# Altium project VHF_AMP.PrjPcb (part 3 of 5)

## Sheet VHFA_DIOT_Connectors_P1_P6.SchDoc: =MainTitle
size 420 x 297 mm; SPICEModelCacheRMUUFYQV: <root> / <DocumentId>RMUUFYQV</DocumentId> / </root>; Author: G.Kasprowicz; CompanyName: WUT ISE; DrawnBy: G.Kasprowicz; Organization: WUT ISE; Address1: PW ISE; Address2: Nowowiejska 15/19 00-665 Warsaw; Address3: gkasprow@gmail.com; DocumentNumber: 5; Revision: 2; SheetNumber: 5; SheetTotal: 9; ModifiedBy: -; CheckedDate: -; Title2: DIOT connectors; DivGrp: WUT ISE; Designer: G.Kasprowicz; ModifiedDate: -; ProjectName: Sensor Box
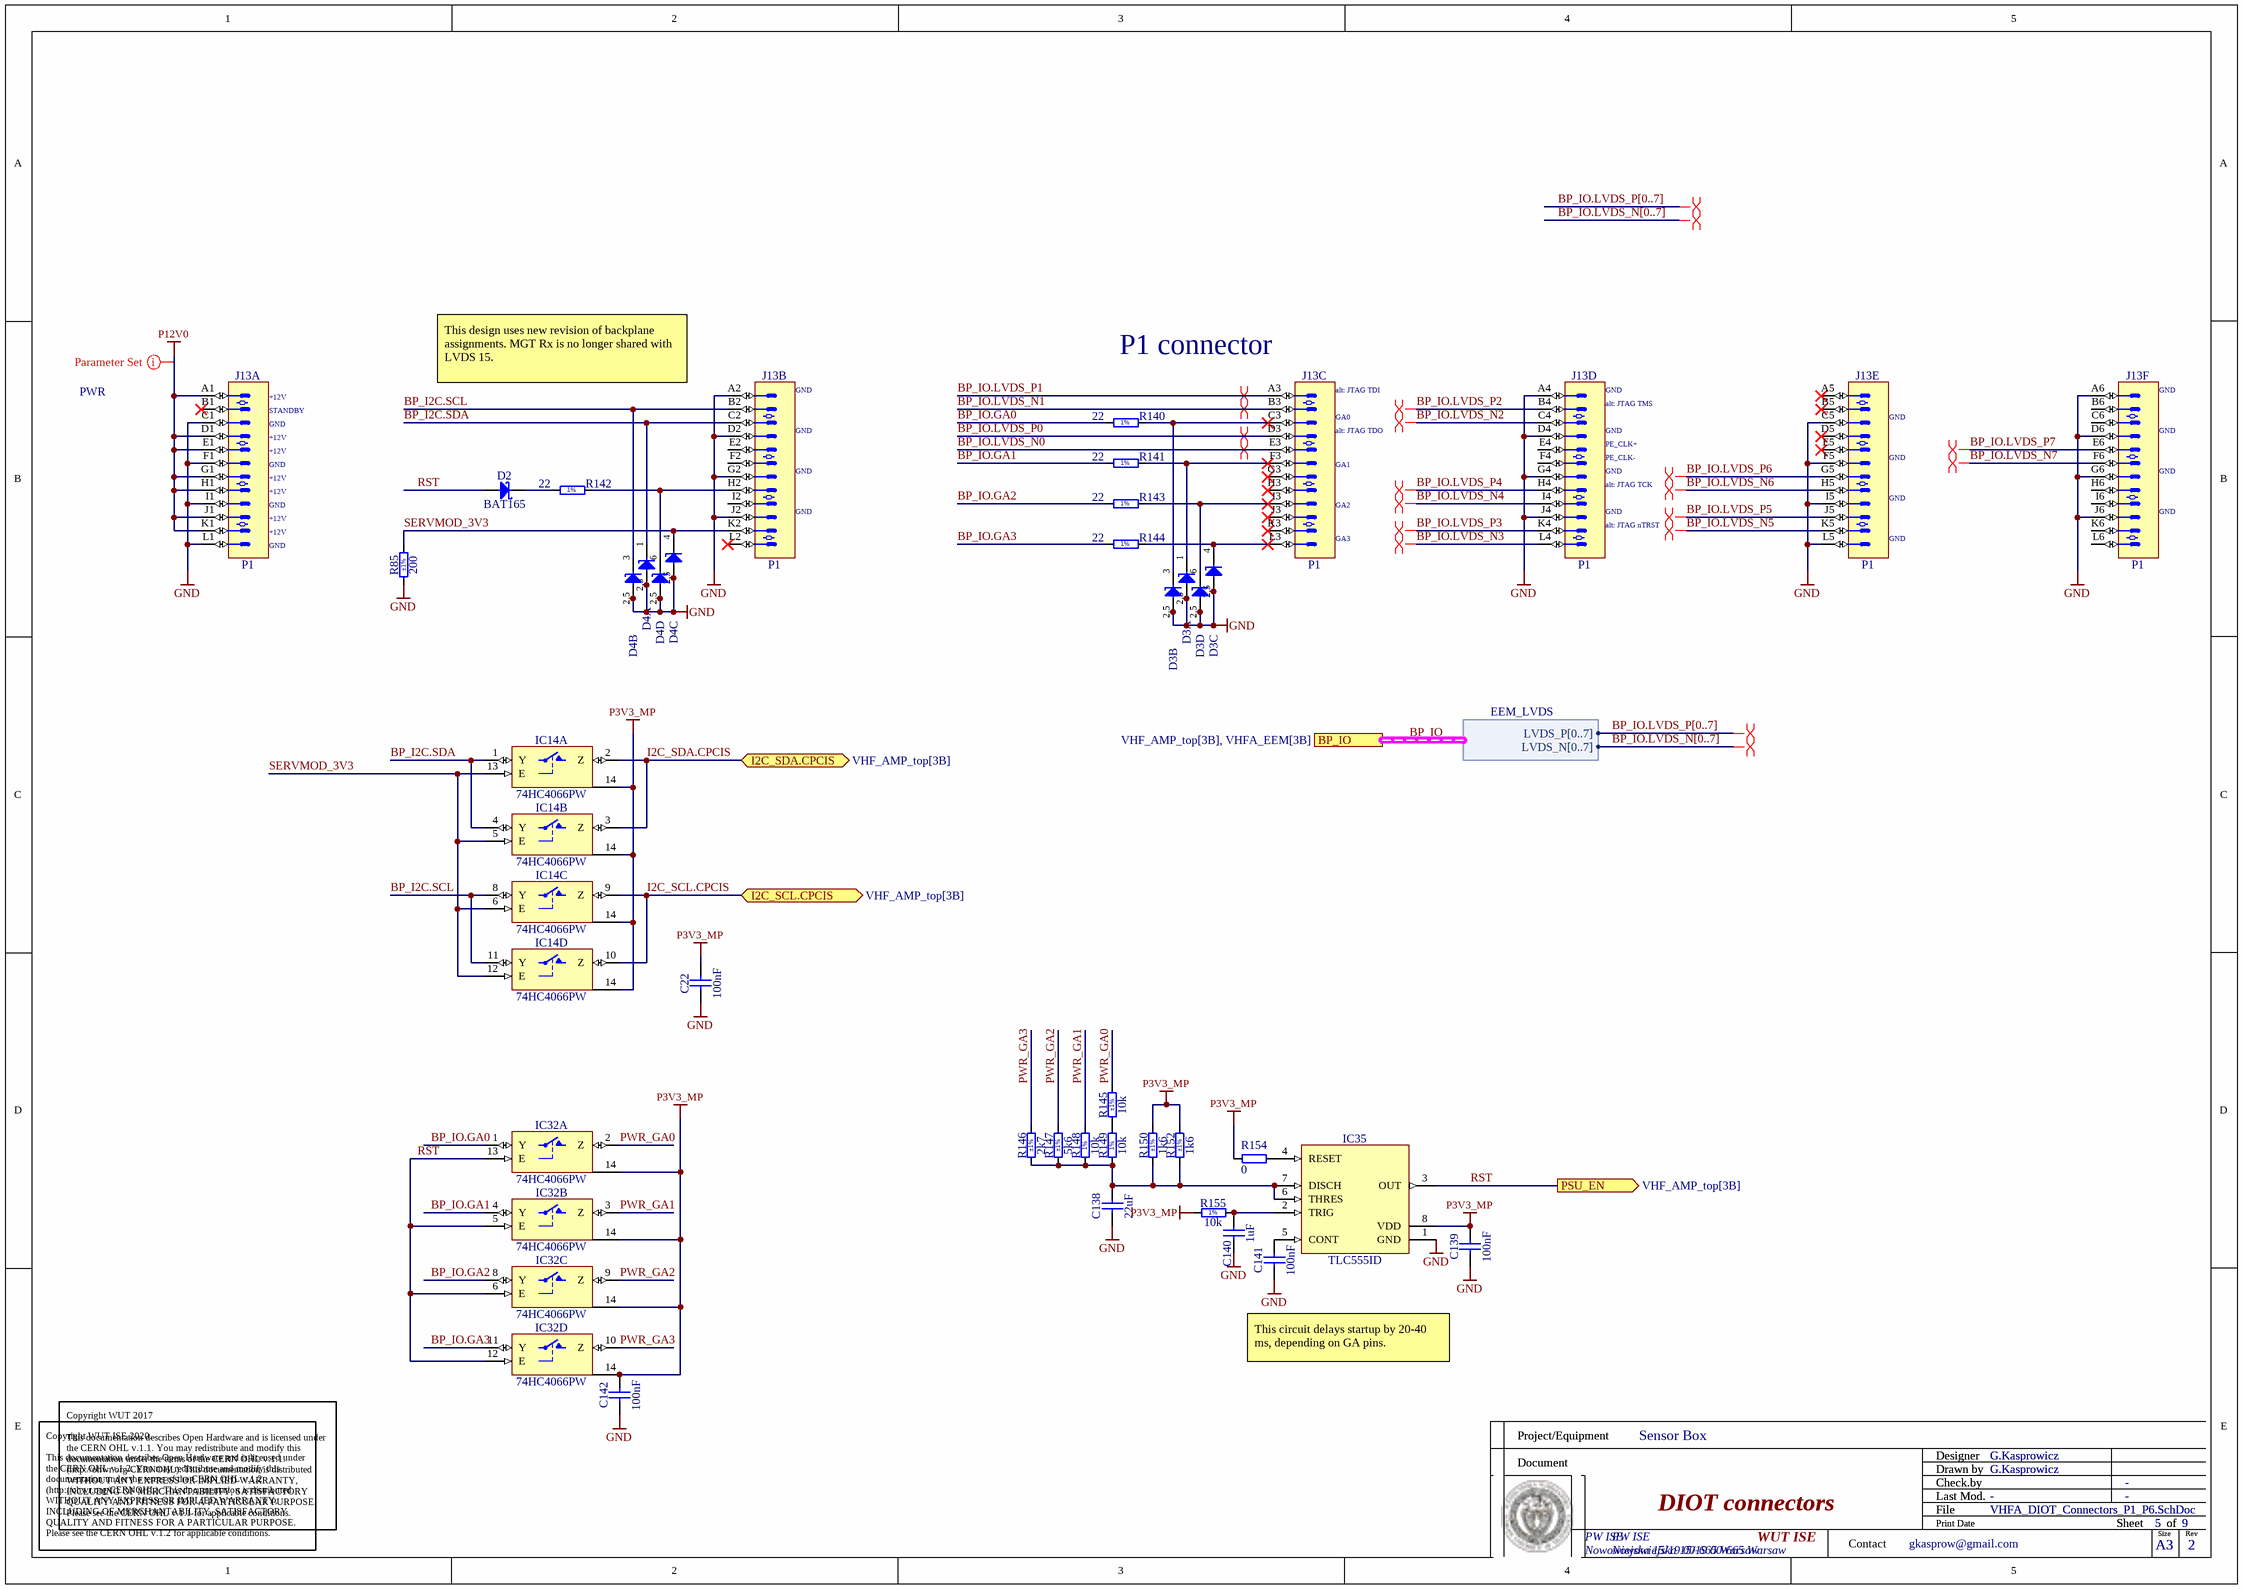
[diagram p4: VHFA_DIOT_Connectors_P1_P6.SchDoc]

### Parts
C22  100nF  [CAPC1608X87N]
C138  22uF  [CAPC3216X180N]
C139  100nF  [CAPC1005X55N]
C140  1uF  [CAPC1005X55N]
C141  100nF  [CAPC1005X55N]
C142  100nF  [CAPC1005X55N]
D2  BAT165  [SOD2512X110N]
D3  PESD3V3S4UD  [SOT95P280X110-6N]  (value not drawn)  (parts A,B,C,D of 4)
D4  PESD3V3S4UD  [SOT95P280X110-6N]  (value not drawn)  (parts A,B,C,D of 4)
IC14  74HC4066PW  [SOP65P640X110-14N]  (parts A,B,C,D of 4)
IC32  74HC4066PW  [SOP65P640X110-14N]  (parts A,B,C,D of 4)
IC35  TLC555ID  [SOIC127P600X175-8N]
J13  P1  [AMPHENOL_10052825-101LF]  (parts A,B,C,D,E,F of 6)
R85  200  Tolerance: ±1%  [RESC1608X55N]
R140  22  [RESC1005X40N]
R141  22  [RESC1005X40N]
R142  22  [RESC1005X40N]
R143  22  [RESC1005X40N]
R144  22  [RESC1005X40N]
R145  10k  Tolerance: ±1%  [RESC1005X40N]
R146  2k7  Tolerance: ±1%  [RESC1608X55N]
R147  5k6  Tolerance: ±1%  [RESC1005X40N]
R148  10k  [RESC1005X40N]
R149  10k  [RESC1005X40N]
R150  1k6  Tolerance: ±1%  [RESC1005X40N]
R152  1k6  Tolerance: ±1%  [RESC1005X40N]
R154  0  [RESC1005X40N]
R155  10k  [RESC1005X40N]

### Ports
BP_IO (harness EEM_LVDS, see VHF_AMP_top[3B], VHFA_EEM[3B]), I2C_SCL.CPCIS (bidir, see VHF_AMP_top[3B]), I2C_SDA.CPCIS (bidir, see VHF_AMP_top[3B]), PSU_EN (out, see VHF_AMP_top[3B])

### Harnesses
EEM_LVDS: LVDS_P[0..7], LVDS_N[0..7]

### Nets
GND: C22.1 C138.1 C139.1 C140.1 C141.1 C142.1 D3.2(A) D3.5(A) D4.2(A) D4.5(A) IC14.7(GND) IC32.7(GND) IC35.1(GND) J13.A2 J13.A4 J13.A6 J13.C1 J13.C5 J13.D2 J13.D4 J13.D6 J13.F1 J13.F5 J13.G2 J13.G4 J13.G6 J13.I1 J13.I5 J13.J2 J13.J4 J13.J6 J13.L1 J13.L5 R85.1
P3V3_MP: C22.2 C139.2 C142.2 IC14.14(VCC) IC32.14(VCC) IC35.8(VDD) R150.2 R152.2 R154.2 R155.1
P12V0: J13.A1 J13.D1 J13.E1 J13.G1 J13.H1 J13.J1 J13.K1
BP_I2C.SCL: D4.3(C) IC14.8(Y) IC14.11(Y) J13.B2
BP_I2C.SDA: D4.1(C) IC14.1(Y) IC14.4(Y) J13.C2
BP_IO.GA0: IC32.1(Y) R140.1
BP_IO.GA1: IC32.4(Y) R141.1
BP_IO.GA2: IC32.8(Y) R143.1
BP_IO.GA3: IC32.11(Y) R144.1
BP_IO.LVDS_N0: J13.E3
BP_IO.LVDS_N1: J13.B3
BP_IO.LVDS_N2: J13.C4
BP_IO.LVDS_N3: J13.L4
BP_IO.LVDS_N4: J13.I4
BP_IO.LVDS_N5: J13.K5
BP_IO.LVDS_N6: J13.H5
BP_IO.LVDS_N7: J13.F6
BP_IO.LVDS_P0: J13.D3
BP_IO.LVDS_P1: J13.A3
BP_IO.LVDS_P2: J13.B4
BP_IO.LVDS_P3: J13.K4
BP_IO.LVDS_P4: J13.H4
BP_IO.LVDS_P5: J13.J5
BP_IO.LVDS_P6: J13.G5
BP_IO.LVDS_P7: J13.E6
I2C_SCL.CPCIS: IC14.9(Z) IC14.10(Z) ; port I2C_SCL.CPCIS
I2C_SDA.CPCIS: IC14.2(Z) IC14.3(Z) ; port I2C_SDA.CPCIS
PWR_GA0: IC32.2(Z) R145.2
PWR_GA1: IC32.3(Z) R148.2
PWR_GA2: IC32.9(Z) R147.2
PWR_GA3: IC32.10(Z) R146.2
RST: D2.2(A) IC32.5(E) IC32.6(E) IC32.12(E) IC32.13(E) IC35.3(OUT) ; port PSU_EN  [project net PS_ON_BP]
SERVMOD_3V3: D4.4(C) IC14.5(E) IC14.6(E) IC14.12(E) IC14.13(E) J13.K2 R85.2
NetC138_2: C138.2 IC35.6(THRES) IC35.7(DISCH) R146.1 R147.1 R148.1 R149.1 R150.1 R152.1
NetC140_2: C140.2 IC35.2(TRIG) R155.2
NetC141_2: C141.2 IC35.5(CONT)
NetD2_1: D2.1(C) R142.1
NetD3_1: D3.1(C) J13.F3 R141.2
NetD3_3: D3.3(C) J13.C3 R140.2
NetD3_4: D3.4(C) J13.L3 R144.2
NetD3_6: D3.6(C) J13.I3 R143.2
NetD4_6: D4.6(C) J13.H2 R142.2
NetIC35_4: IC35.4(RESET) R154.1
NetR145_1: R145.1 R149.2

Not connected (* = marked no-connect by the designer): J13 A5* B1* B5* B6 C6 D5* E2 E4 E5* F2 F4 G3* H3* H6 I2 I6 J3* K3* K6 L2* L6

### Buses and harness runs
bus BP_IO.LVDS_N[0..7]
bus BP_IO.LVDS_P[0..7]
harness BP_IO = port BP_IO

### Layout directives
net class PWR: P12V0
differential pair: (no net found under the mark), BP_IO.LVDS_N0, BP_IO.LVDS_N1, BP_IO.LVDS_N2, BP_IO.LVDS_N3, BP_IO.LVDS_N4, BP_IO.LVDS_N5, BP_IO.LVDS_N6, BP_IO.LVDS_N7, BP_IO.LVDS_P0, BP_IO.LVDS_P1, BP_IO.LVDS_P2, BP_IO.LVDS_P3, BP_IO.LVDS_P4, BP_IO.LVDS_P5, BP_IO.LVDS_P6, BP_IO.LVDS_P7

### Notes on the sheet
- (near J13) +12V
- This design uses new revision of backplane assignments. MGT Rx is no longer shared with LVDS 15.
- (near J13) GND
- (near J13) P1 connector
- (near J13) alt: JTAG TDI
- (near J13) STANDBY
- (near J13) alt: JTAG TDO
- (near J13) GA0
- (near J13) alt: JTAG TMS
- (near J13) PE_CLK+
- (near J13) PE_CLK-
- (near J13) GA2
- (near J13) GA1
- (near J13) alt: JTAG TCK
- (near J13) alt: JTAG nTRST
- (near J13) GA3
- This circuit delays startup by 20-40 ms, depending on GA pins.
- Project/Equipment
- Document
- Designer
- Drawn by
- Check.by
- Copyright WUT ISE 2020.
  This documentation describes Open Hardware and is licensed under the CERN OHL v.1.2. You may redistribute and modify this documentation under the terms of the CERN OHL v.1.2. (http://ohwr.org/CERNOHL). This documentation is distributed WITHOUT ANY EXPRESS OR IMPLIED WARRANTY, INCLUDING OF MERCHANTABILITY, SATISFACTORY QUALITY AND FITNESS FOR A PARTICULAR PURPOSE. Please see the CERN OHL v.1.2 for applicable conditions.
- Copyright WUT 2017
  This documentation describes Open Hardware and is licensed under the CERN OHL v.1.1. You may redistribute and modify this documentation under the terms of the CERN OHL v.1.1. (http://ohwr.org/CERNOHL). This documentation is distributed WITHOUT ANY EXPRESS OR IMPLIED WARRANTY, INCLUDING OF MERCHANTABILITY, SATISFACTORY QUALITY AND FITNESS FOR A PARTICULAR PURPOSE. Please see the CERN OHL v.1.1 for applicable conditions.
- Contact
- File
- Last Mod.
- Print Date
- Sheet
- Size
- A3
- of
- Rev
- (in symbol PESD3V3S4UD, part A) 2,5
- (in symbol PESD3V3S4UD, part B) 2,5
- (in symbol PESD3V3S4UD, part C) 2,5
- (in symbol PESD3V3S4UD, part D) 2,5
- (in symbol R0402_1k_1%_0.0625W_100PPM) 1%
- (in symbol R0402_10K_1%_0.0625W_100PPM) 1%
- (in symbol R0402_22R_1%_0.0625W_100PPM) 1%

### Library data of the parts
C22 = CC0603_100NF_50V_10%_X7R: Non-polarised capacitor; Part Description: SMD Multilayer Chip Ceramic Capacitor; Manufacturer: GENERIC; Manufacturer1 Part Number: 223858615649; Voltage: 50V; TC: X7R; Tolerance: ±10%; Part Number: CC0603_100NF_50V_10%_X7R; Component Kind: Standard; Component Type: Standard; Pin Count: 2; Value: 100nF; Status: Preferred; Manufacturer Part Number: CC0603_100NF_50V_10%_X7R; Case: 0603; Mounted: Yes; Socket: No; SMD: Yes; Sense: No; Manufacturer1 Example: PHYCOMP; Manufacturer1 ComponentHeight: 0.87mm; HelpURL: \\cern.ch\dfs\Applications\Altium\Datasheets\CC0603_X7R_PHYCOMP.pdf; Author: CERN DEM JLC; CreateDate: 03.12.2007; LatestRevisionDate: 03.12.2007
C138 = CC1206_22UF_35V_20%_JB_TDK_C3216JB1V226M160AC: Non-polarised capacitor; Part Description: SMD Multilayer Chip Ceramic Capacitor; Manufacturer: TDK; Voltage: 35V; TC: JB(±10%); Tolerance: ±20%; Part Number: CC1206_22UF_35V_20%_JB_TDK_C3216JB1V226M160AC; Component Kind: Standard; Component Type: Standard; Pin Count: 2; Value: 22uF; Status: None; Manufacturer Part Number: C3216JB1V226M160AC; Case: 1206; Mounted: Yes; Socket: No; SMD: Yes; Sense: No; HelpURL: \\cern.ch\dfs\Applications\Altium\Datasheets\CC1206_TDK_C3216JB1V226M160AC.pdf; Author: CERN DEM JLC; CreateDate: 13.07.2017; LatestRevisionDate: 13.07.2017; ComponentHeight: 1.8mm
C139 C141 C142 = CC0402_100NF_16V_10%_X5R: as C108 on sheet VHF_AMP_top; Part Number: CC0402_100NF_16V_10%_X5R; Component Kind: Standard; Component Type: Standard; Pin Count: 2; Value: 100nF; Status: None; Manufacturer Part Number: CC0402_100NF_16V_10%_X5R; Case: 0402; Mounted: Yes; Socket: No; SMD: Yes; Sense: No; Manufacturer1 Example: MURATA; Manufacturer1 ComponentHeight: 0.55mm; HelpURL: \\cern.ch\dfs\Applications\Altium\Datasheets\CC0402_X5R_MURATA_GRM.pdf; Author: CERN DEM JLC; CreateDate: 10.12.2013; LatestRevisionDate: 10.12.2013
C140 = CC0402_1UF_16V_10%_X5R: as C69 on sheet VHF_AMP_top; Part Number: CC0402_1UF_16V_10%_X5R; Component Kind: Standard; Component Type: Standard; Pin Count: 2; Value: 1uF; Status: Preferred; Manufacturer Part Number: CC0402_1UF_16V_10%_X5R; Case: 0402; Mounted: Yes; Socket: No; SMD: Yes; Sense: No; Manufacturer1 Example: TDK; Manufacturer1 ComponentHeight: 0.55mm; HelpURL: \\cern.ch\dfs\Applications\Altium\Datasheets\CC0402_X5R_TDK_C.pdf; Author: CERN DEM JLC; CreateDate: 2012-10-25; LatestRevisionDate: 2012-10-25
D2 = BAT165: Schottky Diode; Part Description: Medium Power AF Schottky Diode; Manufacturer: INFINEON; Voltage: 40V; Power: 750mA; PressFit: No; Bonding: No; Part Number: BAT165; Component Kind: Standard; Component Type: Standard; Device: BAT165; PackageDescription: Small Outline Diode (SOD-323), 1.70mm W X 1.25mm L X 1.10mm H body,  IPC Medium Density; Manufacturer Part Number: BAT165; Pin Count: 2; Case: SOD-323; Mounted: Yes; Socket: No; SMD: Yes; Sense: No; ComponentHeight: 1.1mm; HelpURL: \\cern.ch\dfs\Applications\Altium\Datasheets\BAT165.pdf; Author: CERN DEM JLC; CreateDate: 12.11.2014; LatestRevisionDate: 12.11.2014
D3 D4 = PESD3V3S4UD: Quad Common Anode ESD Protection Diodes (30kV); Manufacturer: NXP SEMICONDUCTORS; Voltage: 3V3; Power: 200W; PressFit: No; Bonding: No; Part Number: PESD3V3S4UD; Component Kind: Standard; Component Type: Standard; Device: PESD3V3S4UD; PackageDescription: SOT, 0.95mm Pitch; 6 Pin, 1.60mm W X 2.90mm L X 1.10mm H body, IPC Medium Density; Part Description: Quad Common Anode ESD Protection Diodes (30kV); Manufacturer Part Number: PESD3V3S4UD; Pin Count: 6; Case: SOT23-6; Mounted: Yes; Socket: No; SMD: Yes; Sense: No; ComponentHeight: 1.1mm; HelpURL: \\cern.ch\dfs\Applications\Altium\Datasheets\PESD3V3S4UD.pdf; Author: CERN DEM MR; CreateDate: 08.02.2016; LatestRevisionDate: 16.01.2018
IC14 IC32 = 74HC4066PW: Part Description: Quad Single-Pole Single-Throw Analog Switch; Manufacturer: NXP SEMICONDUCTORS; PressFit: No; Bonding: No; Part Number: 74HC4066PW; Component Kind: Standard; Component Type: Standard; Device: 74HC4066PW; PackageDescription: SOP, 14-Leads, Body 4.4x5mm (max), Pitch 0.65mm, IPC Medium Density; Manufacturer Part Number: 74HC4066PW; Pin Count: 14; Case: TSSOP14; Mounted: Yes; Socket: No; SMD: Yes; Sense: No; ComponentHeight: 1.1mm; Author: CERN DEM JLC; HelpURL: \\cern.ch\dfs\Applications\Altium\Datasheets\74HC4066PW.pdf; CreateDate: 19.11.2014; LatestRevisionDate: 19.11.2014
IC35 = TLC555ID: LinCMOS Timer; Manufacturer: TEXAS INSTRUMENTS; PressFit: No; Bonding: No; Part Number: TLC555ID; Component Kind: Standard; Component Type: Standard; Device: TLC555ID; PackageDescription: SOIC 8, Pitch 1.27mm, Body 4x5mm, IPC Medium Density; Part Description: LinCMOS Timer; Manufacturer Part Number: TLC555ID; Pin Count: 8; Case: SOIC8; Mounted: Yes; Socket: No; SMD: Yes; Sense: No; ComponentHeight: 1.75mm; Author: CERN DEM JMW; HelpURL: \\cern.ch\dfs\Applications\Altium\Datasheets\TLC555ID.pdf; CreateDate: 23.08.2016; LatestRevisionDate: 23.08.2016
J13 = AMPHENOL_10052825-101LF: 72 Contacts Header, 6 Columns, 4 Pairs per Column; Part Description: 72 Contacts, 2mm Pitch, 6 Columns, 4 Pairs per Column, 4 Walls, Right Angle Header; Part Number: AMPHENOL_10052825-101LF; Component Kind: Standard; Component Type: Standard; Pin Count: 72; Family: AirMax VS; Mounted: Yes; Socket: No; SMD: No; PressFit: Yes; Sense: No; Status: None; Manufacturer: AMPHENOL; Manufacturer Part Number: 10052825-101LF; ComponentHeight: 15.35mm; HelpURL: \\cern.ch\dfs\Applications\Altium\Datasheets\AMPHENOL_10052825-101LF.pdf; ComponentLink1URL: \\cern.ch\dfs\Applications\Altium\Datasheets\AMPHENOL_10052825-101LF_Application.pdf; ComponentLink1Description: Application; Author: CERN DEM MR; CreateDate: 19/02/2018; LatestRevisionDate: 19/02/2018; Classname: Overlapping
R85 = R0603_200R_1%_0.1W_100PPM: Resistor - 1%; Part Description: General Purpose Thick Film Chip Resistor; Manufacturer: GENERIC; Manufacturer1 Part Number: NRC06F2000TRF; Power: 0.1W; TC: ±100ppm/°C; PressFit: No; Part Number: R0603_200R_1%_0.1W_100PPM; Component Kind: Standard; Component Type: Standard; Pin Count: 2; Value: 200; Status: Preferred; Manufacturer Part Number: R0603_200R_1%_0.1W_100PPM; Case: 0603; Mounted: Yes; Sense: No; Socket: No; SMD: Yes; Manufacturer1 Example: NIC COMPONENT; Manufacturer1 ComponentHeight: 0.55mm; HelpURL: \\cern.ch\dfs\Applications\Altium\Datasheets\R0603_NIC_NRC.pdf; Author: CERN DEM JLC; CreateDate: 03.12.2007; LatestRevisionDate: 13.03.2008
R140 R141 R143 R144 = R0402_22R_1%_0.0625W_100PPM: Resistor - 1%; Part Description: General Purpose Thick Film Chip Resistor; Manufacturer: GENERIC; Manufacturer1 Part Number: 232270672209L; TC: ±100ppm/°C; PressFit: No; Part Number: R0402_22R_1%_0.0625W_100PPM; Component Kind: Standard; Component Type: Standard; Pin Count: 2; Value: 22; Status: Not Recommended; Power: 0.0625W; Tolerance: ±1%; Manufacturer Part Number: R0402_22R_1%_0.0625W_100PPM; Case: 0402; Mounted: Yes; Socket: No; SMD: Yes; Manufacturer1 Example: YAGEO PHYCOMP; Manufacturer1 ComponentHeight: 0.4mm; HelpURL: \\cern.ch\dfs\Applications\Altium\Datasheets\R0402_Phycomp_RC0402.pdf; Author: CERN DEM JLC; CreateDate: 03.12.2007; LatestRevisionDate: 17.10.2012; Sense: No
R142 = R0402_22R_1%_0.0625W_100PPM: Resistor - 1%; Part Description: General Purpose Thick Film Chip Resistor; Manufacturer: GENERIC; Manufacturer1 Part Number: 232270672209L; PressFit: No; Part Number: R0402_22R_1%_0.0625W_100PPM; Component Kind: Standard; Component Type: Standard; Pin Count: 2; Value: 22; Status: Not Recommended; Power: 0.0625W; Tolerance: ±1%; Manufacturer Part Number: R0402_22R_1%_0.0625W_100PPM; Case: 0402; Mounted: Yes; Socket: No; SMD: Yes; Manufacturer1 Example: YAGEO PHYCOMP; Manufacturer1 ComponentHeight: 0.4mm; HelpURL: \\cern.ch\dfs\Applications\Altium\Datasheets\R0402_Phycomp_RC0402.pdf; Author: CERN DEM JLC; CreateDate: 03.12.2007; LatestRevisionDate: 17.10.2012; Sense: No
R145 = R0402_10k_1%_0.0625W_100PPM: Resistor - 1%; Part Description: General Purpose Thick Film Chip Resistor; Manufacturer: GENERIC; Manufacturer1 Part Number: 232270671003L; TC: ±100ppm/°C; PressFit: No; Part Number: R0402_10K_1%_0.0625W_100PPM; Component Kind: Standard; Component Type: Standard; Pin Count: 2; Value: 10k; Status: Not Recommended; Power: 0.0625W; Manufacturer Part Number: R0402_10K_1%_0.0625W_100PPM; Case: 0402; Mounted: Yes; Sense: No; Socket: No; SMD: Yes; Manufacturer1 Example: YAGEO PHYCOMP; Manufacturer1 ComponentHeight: 0.4mm; HelpURL: \\cern.ch\dfs\Applications\Altium\Datasheets\R0402_Phycomp_RC0402.pdf; Author: CERN DEM JLC; CreateDate: 2007-12-03; LatestRevisionDate: 2012-10-17
R146 = R0603_2K7_1%_0.1W_100PPM: Resistor - 1%; Part Description: General Purpose Thick Film Chip Resistor; Manufacturer: GENERIC; Manufacturer1 Part Number: RC0603FR-072K7L; Power: 0.1W; TC: ±100ppm/°C; PressFit: No; Part Number: R0603_2K7_1%_0.1W_100PPM; Component Kind: Standard; Component Type: Standard; Pin Count: 2; Value: 2k7; Status: Preferred; Manufacturer Part Number: R0603_2K7_1%_0.1W_100PPM; Case: 0603; Mounted: Yes; Sense: No; Socket: No; SMD: Yes; Manufacturer1 Example: YAGEO PHYCOMP; Manufacturer1 ComponentHeight: 0.55mm; HelpURL: \\cern.ch\dfs\Applications\Altium\Datasheets\R0603_PHYCOMP_RC0603.pdf; Author: CERN DEM JLC; CreateDate: 2011-05-02; LatestRevisionDate: 2011-05-02
R147 = R0402_5K6_1%_0.0625W_100PPM: Resistor - 1%; Part Description: General Purpose Thick Film Chip Resistor; Manufacturer: GENERIC; Manufacturer1 Part Number: 232270675602L; TC: ±100ppm/°C; PressFit: No; Part Number: R0402_5K6_1%_0.0625W_100PPM; Component Kind: Standard; Component Type: Standard; Pin Count: 2; Value: 5k6; Status: Not Recommended; Power: 0.0625W; Manufacturer Part Number: R0402_5K6_1%_0.0625W_100PPM; Case: 0402; Mounted: Yes; Sense: No; Socket: No; SMD: Yes; Manufacturer1 Example: YAGEO PHYCOMP; Manufacturer1 ComponentHeight: 0.4mm; HelpURL: \\cern.ch\dfs\Applications\Altium\Datasheets\R0402_Phycomp_RC0402.pdf; Author: CERN DEM JLC; CreateDate: 2007-12-03; LatestRevisionDate: 2012-10-17
R148 R149 = R0402_1k_1%_0.0625W_100PPM: Resistor - 1%; Part Description: General Purpose Thick Film Chip Resistor; Manufacturer: GENERIC; Manufacturer1 Part Number: 232270671002L; PressFit: No; Part Number: R0402_1K_1%_0.0625W_100PPM; Component Kind: Standard; Component Type: Standard; Pin Count: 2; Value: 10k; Status: Not Recommended; Power: 0.0625W; Tolerance: ±1%; Manufacturer Part Number: R0402_1K_1%_0.0625W_100PPM; Case: 0402; Mounted: Yes; Sense: No; Socket: No; SMD: Yes; Manufacturer1 Example: YAGEO PHYCOMP; Manufacturer1 ComponentHeight: 0.4mm; HelpURL: \\cern.ch\dfs\Applications\Altium\Datasheets\R0402_Phycomp_RC0402.pdf; Author: CERN DEM JLC; CreateDate: 03.12.2007; LatestRevisionDate: 17.10.2012
R150 R152 = R0402_1K6_1%_0.0625W_100PPM: Resistor - 1%; Part Description: General Purpose Thick Film Chip Resistor; Manufacturer: GENERIC; Manufacturer1 Part Number: 232270671602L; TC: ±100ppm/°C; PressFit: No; Part Number: R0402_1K6_1%_0.0625W_100PPM; Component Kind: Standard; Component Type: Standard; Pin Count: 2; Value: 1k6; Status: Not Recommended; Power: 0.0625W; Manufacturer Part Number: R0402_1K6_1%_0.0625W_100PPM; Case: 0402; Mounted: Yes; Sense: No; Socket: No; SMD: Yes; Manufacturer1 Example: YAGEO PHYCOMP; Manufacturer1 ComponentHeight: 0.4mm; HelpURL: \\cern.ch\dfs\Applications\Altium\Datasheets\R0402_Phycomp_RC0402.pdf; Author: CERN DEM JLC; CreateDate: 2007-12-03; LatestRevisionDate: 2012-10-17
R154 = R0402_0R_JUMPER: Resistor; Part Description: 1A (0.05R Max DC Resistance) Zero Ohm Jumper; Manufacturer: GENERIC; Manufacturer1 Part Number: 232270591001L; Part Number: R0402_0R_JUMPER; Component Kind: Standard; Component Type: Standard; Pin Count: 2; Value: 0; Status: Not recommended; Manufacturer Part Number: R0402_0R_JUMPER; Case: 0402; Mounted: Yes; Sense: No; Socket: No; SMD: Yes; Manufacturer1 Example: YAGEO PHYCOMP; Manufacturer1 ComponentHeight: 0.4mm; HelpURL: \\cern.ch\dfs\Applications\Altium\Datasheets\R0402_Phycomp_RC0402.pdf; Author: CERN DEM JLC; CreateDate: 03.12.2007; LatestRevisionDate: 17.10.2012
R155 = R0402_10K_1%_0.0625W_100PPM: Resistor - 1%; Part Description: General Purpose Thick Film Chip Resistor; Manufacturer: GENERIC; Manufacturer1 Part Number: 232270671003L; TC: ±100ppm/°C; PressFit: No; Part Number: R0402_10K_1%_0.0625W_100PPM; Component Kind: Standard; Component Type: Standard; Pin Count: 2; Value: 10k; Status: Not Recommended; Power: 0.0625W; Tolerance: ±1%; Manufacturer Part Number: R0402_10K_1%_0.0625W_100PPM; Case: 0402; Mounted: Yes; Sense: No; Socket: No; SMD: Yes; Manufacturer1 Example: YAGEO PHYCOMP; Manufacturer1 ComponentHeight: 0.4mm; HelpURL: \\cern.ch\dfs\Applications\Altium\Datasheets\R0402_Phycomp_RC0402.pdf; Author: CERN DEM JLC; CreateDate: 2007-12-03; LatestRevisionDate: 2012-10-17

## Sheet VHFA_EEM.SchDoc: =MainTitle
size 420 x 297 mm; EDA_Number: ARTIQ; Projet: ARTIQ/SINARA; Author: G.Kasprowicz; CompanyName: WUT ISE; DrawnBy: G.Kasprowicz; Organization: WUT ISE; Address1: PW ISE; Address2: Nowowiejska 15/19 00-665 Warsaw; Address3: gkasprow@gmail.com; DocumentNumber: 7; Revision: 2; SheetNumber: 6; SheetTotal: 9; ModifiedBy: -; CheckedDate: -; Title2: EEM connectors; DivGrp: WUT ISE; Designer: G.Kasprowicz; SPICEModelCache: <root> / <DocumentId>MJNKMGWL</DocumentId> / </root>; ModifiedDate: -; ProjectName: Sensor Box
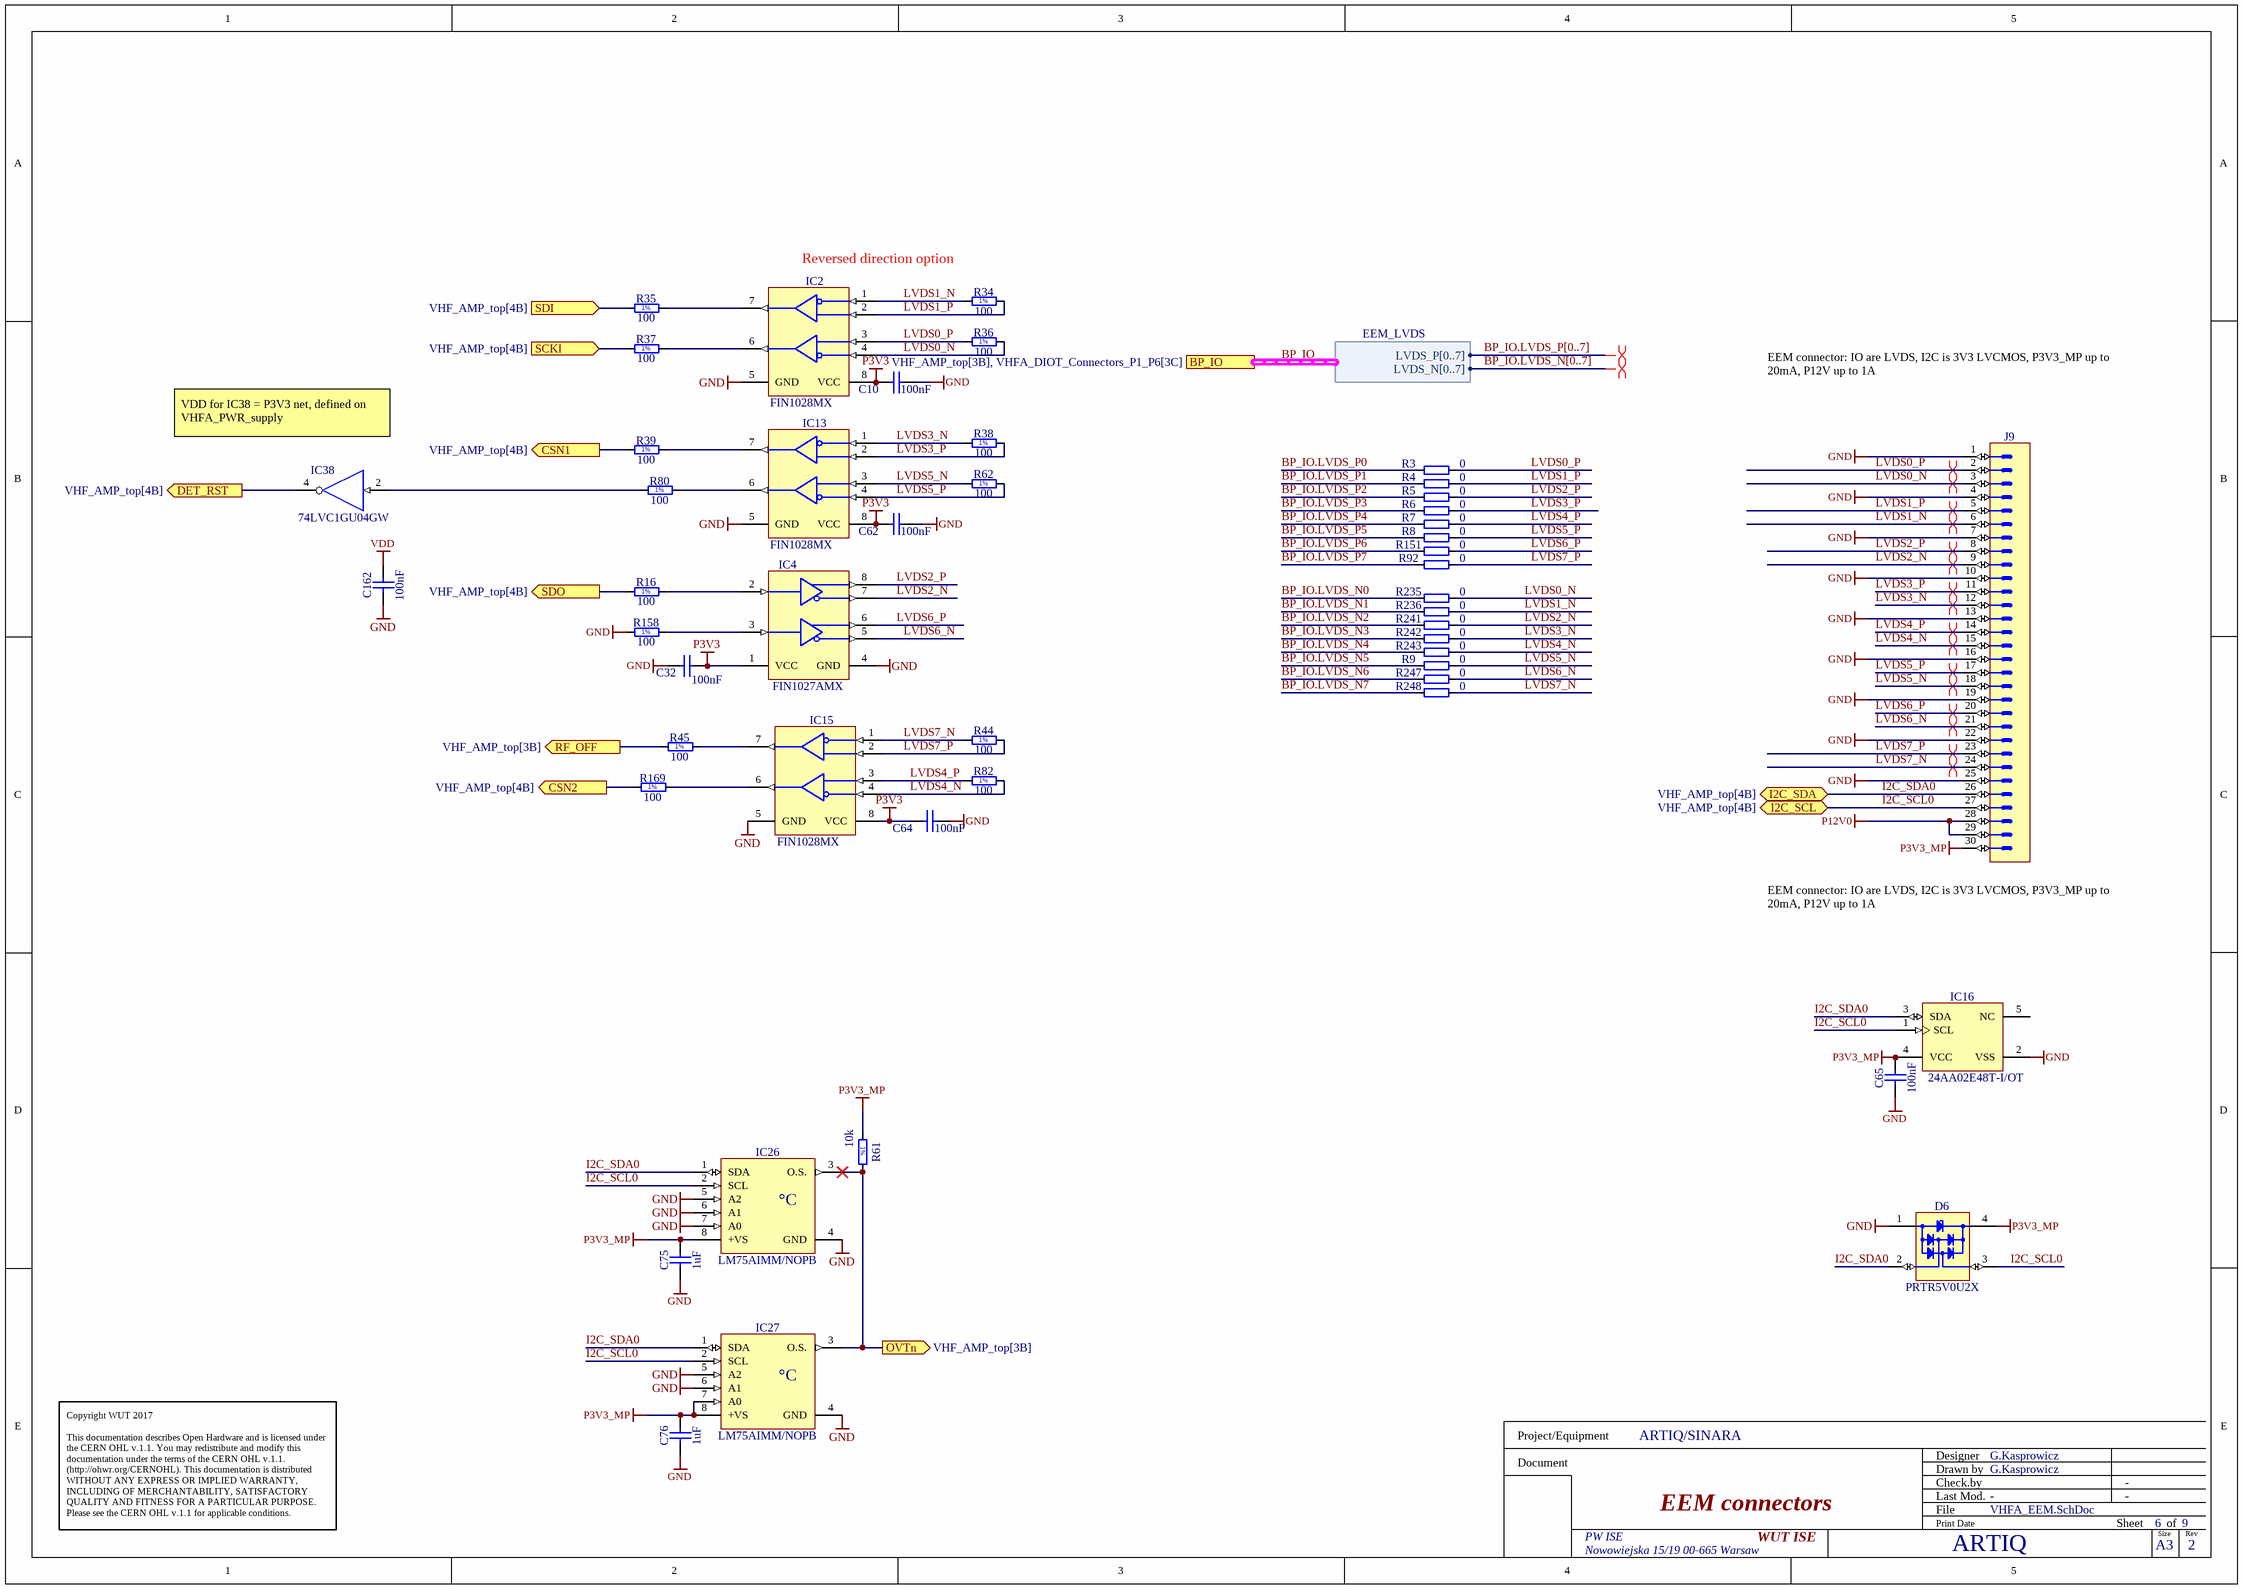
[diagram p5: VHFA_EEM.SchDoc]

### Parts
C10  100nF  [CAPC1005X55N]
C32  100nF  [CAPC1005X55N]
C62  100nF  [CAPC1005X55N]
C64  100nF  [CAPC1005X55N]
C65  100nF  [CAPC1005X55N]
C75  1uF  [CAPC1005X55N]
C76  1uF  [CAPC1005X55N]
C162  100nF  [CAPC1005X55N]
D6  PRTR5V0U2X  [SOT190P230X110-4N]
IC2  FIN1028MX  [SOIC127P600X175-8N]
IC4  FIN1027AMX  [SOIC127P600X175-8N]
IC13  FIN1028MX  [SOIC127P600X175-8N]
IC15  FIN1028MX  [SOIC127P600X175-8N]
IC16  24AA02E48T-I/OT  [SOT95P280X145-5N]
IC26  LM75AIMM/NOPB  [SOP65P490X109-8N]
IC27  LM75AIMM/NOPB  [SOP65P490X109-8N]
IC38  74LVC1GU04GW  [SOT65P212X110-5N]
J9  (no value)  [3M_N2530-6002RB]
R3  0  [RESC1005X40N]
R4  0  [RESC1005X40N]
R5  0  [RESC1005X40N]
R6  0  [RESC1005X40N]
R7  0  [RESC1005X40N]
R8  0  [RESC1005X40N]
R9  0  [RESC1005X40N]
R16  100  [RESC1005X40N]
R34  100  [RESC1005X40N]
R35  100  [RESC1005X40N]
R36  100  [RESC1005X40N]
R37  100  [RESC1005X40N]
R38  100  [RESC1005X40N]
R39  100  [RESC1005X40N]
R44  100  [RESC1005X40N]
R45  100  [RESC1005X40N]
R61  10k  [RESC1005X40N]
R62  100  [RESC1005X40N]
R80  100  [RESC1005X40N]
R82  100  [RESC1005X40N]
R92  0  [RESC1005X40N]
R151  0  [RESC1005X40N]
R158  100  [RESC1005X40N]
R169  100  [RESC1005X40N]
R235  0  [RESC1005X40N]
R236  0  [RESC1005X40N]
R241  0  [RESC1005X40N]
R242  0  [RESC1005X40N]
R243  0  [RESC1005X40N]
R247  0  [RESC1005X40N]
R248  0  [RESC1005X40N]

### Ports
BP_IO (harness EEM_LVDS, see VHF_AMP_top[3B], VHFA_DIOT_Connectors_P1_P6[3C]), CSN1 (out, see VHF_AMP_top[4B]), CSN2 (out, see VHF_AMP_top[4B]), DET_RST (out, see VHF_AMP_top[4B]), I2C_SCL (bidir, see VHF_AMP_top[4B]), I2C_SDA (bidir, see VHF_AMP_top[4B]), OVTn (out, see VHF_AMP_top[3B]), RF_OFF (out, see VHF_AMP_top[3B]), SCKI (in, see VHF_AMP_top[4B]), SDI (in, see VHF_AMP_top[4B]), SDO (out, see VHF_AMP_top[4B])

### Harnesses
EEM_LVDS: LVDS_P[0..7], LVDS_N[0..7]

### Nets
GND: C10.1 C32.1 C62.1 C64.1 C65.1 C75.1 C76.1 C162.1 D6.1(GND) IC2.5(GND) IC4.4(GND) IC13.5(GND) IC15.5(GND) IC16.2(VSS) IC26.4(GND) IC26.5(A2) IC26.6(A1) IC26.7(A0) IC27.4(GND) IC27.5(A2) IC27.6(A1) IC38.3(GND) J9.1 J9.4 J9.7 J9.10 J9.13 J9.16 J9.19 J9.22 J9.25 R158.1
P3V3: C10.2 C32.2 C62.2 C64.2 C162.2 IC2.8(VCC) IC4.1(VCC) IC13.8(VCC) IC15.8(VCC) IC38.5(VCC)  [also labelled VDD]
P3V3_MP: C65.2 C75.2 C76.2 D6.4(VCC) IC16.4(VCC) IC26.8(+VS) IC27.7(A0) IC27.8(+VS) J9.30 R61.1
P12V0: J9.28 J9.29
BP_IO.LVDS_N0: R235.1
BP_IO.LVDS_N1: R236.1
BP_IO.LVDS_N2: R241.1
BP_IO.LVDS_N3: R242.1
BP_IO.LVDS_N4: R243.1
BP_IO.LVDS_N5: R9.1
BP_IO.LVDS_N6: R247.1
BP_IO.LVDS_N7: R248.1
BP_IO.LVDS_P0: R3.1
BP_IO.LVDS_P1: R4.1
BP_IO.LVDS_P2: R5.1
BP_IO.LVDS_P3: R6.1
BP_IO.LVDS_P4: R7.1
BP_IO.LVDS_P5: R8.1
BP_IO.LVDS_P6: R151.1
BP_IO.LVDS_P7: R92.1
I2C_SCL0: D6.3(I/O2) IC16.1(SCL) IC26.2(SCL) IC27.2(SCL) J9.27 ; port I2C_SCL  [project net I2C_SCL.CPCIS]
I2C_SDA0: D6.2(I/O1) IC16.3(SDA) IC26.1(SDA) IC27.1(SDA) J9.26 ; port I2C_SDA  [project net I2C_SDA.CPCIS]
LVDS0_N: IC2.4(RIN2-) J9.3 R36.2 R235.2
LVDS0_P: IC2.3(RIN2+) J9.2 R3.2 R36.1
LVDS1_N: IC2.1(RIN1-) J9.6 R34.1 R236.2
LVDS1_P: IC2.2(RIN1+) J9.5 R4.2 R34.2
LVDS2_N: IC4.7(DOUT-) J9.9 R241.2
LVDS2_P: IC4.8(DOUT+) J9.8 R5.2
LVDS3_N: IC13.1(RIN1-) J9.12 R38.1 R242.2
LVDS3_P: IC13.2(RIN1+) J9.11 R6.2 R38.2
LVDS4_N: IC15.4(RIN2-) J9.15 R82.2 R243.2
LVDS4_P: IC15.3(RIN2+) J9.14 R7.2 R82.1
LVDS5_N: IC13.3(RIN2+) J9.18 R9.2 R62.1
LVDS5_P: IC13.4(RIN2-) J9.17 R8.2 R62.2
LVDS6_N: IC4.5(DOUT-) J9.21 R247.2
LVDS6_P: IC4.6(DOUT+) J9.20 R151.2
LVDS7_N: IC15.1(RIN1-) J9.24 R44.1 R248.2
LVDS7_P: IC15.2(RIN1+) J9.23 R44.2 R92.2
RF_DIS: R45.1 ; port RF_OFF
SPI_MISO: R35.1 ; port SDI
SPI_MOSI: R16.1 ; port SDO
SPI_NCS1: R39.1 ; port CSN1
SPI_NCS2: R169.1 ; port CSN2
SPI_SCK: R37.1 ; port SCKI
NetIC2_6: IC2.6(ROUT2) R37.2
NetIC2_7: IC2.7(ROUT1) R35.2
NetIC4_2: IC4.2(DIN1) R16.2
NetIC4_3: IC4.3(DIN2RIN-) R158.2
NetIC13_6: IC13.6(ROUT2) R80.2
NetIC13_7: IC13.7(ROUT1) R39.2
NetIC15_6: IC15.6(ROUT2) R169.2
NetIC15_7: IC15.7(ROUT1) R45.2
NetIC26_3: IC26.3(O.S.) IC27.3(O.S.) R61.2 ; port OVTn
NetIC38_2: IC38.2(IN) R80.1
NetIC38_4: IC38.4(OUT) ; port DET_RST

Not connected (* = marked no-connect by the designer): IC16 5(NC)

### Buses and harness runs
bus BP_IO.LVDS_N[0..7]
bus BP_IO.LVDS_P[0..7]
harness BP_IO = port BP_IO

### Layout directives
differential pair; differential pair class EEM0; net class EEM0: LVDS0_N, LVDS0_P, LVDS1_N, LVDS1_P, LVDS2_N, LVDS2_P, LVDS3_N, LVDS3_P, LVDS4_N, LVDS4_P, LVDS5_N, LVDS5_P, LVDS6_N, LVDS6_P, LVDS7_N, LVDS7_P
differential pair: (no net found under the mark)

### Notes on the sheet
- Reversed direction option
- VDD for IC38 = P3V3 net, defined on VHFA_PWR_supply
- (near J9) EEM connector: IO are LVDS, I2C is 3V3 LVCMOS, P3V3_MP up to 20mA, P12V up to 1A
- Project/Equipment
- Document
- Designer
- Drawn by
- Check.by
- Copyright WUT 2017
  This documentation describes Open Hardware and is licensed under the CERN OHL v.1.1. You may redistribute and modify this documentation under the terms of the CERN OHL v.1.1. (http://ohwr.org/CERNOHL). This documentation is distributed WITHOUT ANY EXPRESS OR IMPLIED WARRANTY, INCLUDING OF MERCHANTABILITY, SATISFACTORY QUALITY AND FITNESS FOR A PARTICULAR PURPOSE. Please see the CERN OHL v.1.1 for applicable conditions.
- File
- Last Mod.
- Print Date
- Sheet
- Size
- A3
- of
- Rev
- (in symbol LM75AIMM/NOPB) °C
- (in symbol R0402_10K_1%_0.0625W_100PPM) 1%
- (in symbol R0402_100R_1%_0.0625W_100PPM) 1%

### Library data of the parts
C10 C32 C62 C64 C65 C162 = CC0402_100NF_16V_10%_X5R: Non-polarised capacitor; Part Description: SMD Multilayer Chip Ceramic Capacitor; Manufacturer: GENERIC; Manufacturer1 Part Number: GRM155R61C104KA88D; Voltage: 16V; TC: X5R; Tolerance: ±10%; Part Number: CC0402_100NF_16V_10%_X5R; Component Kind: Standard; Component Type: Standard; Pin Count: 2; Value: 100nF; Status: None; Manufacturer Part Number: CC0402_100NF_16V_10%_X5R; Case: 0402; Mounted: Yes; Socket: No; SMD: Yes; Sense: No; Manufacturer1 Example: MURATA; Manufacturer1 ComponentHeight: 0.55mm; HelpURL: \\cern.ch\dfs\Applications\Altium\Datasheets\CC0402_X5R_MURATA_GRM.pdf; Author: CERN DEM JLC; CreateDate: 10.12.2013; LatestRevisionDate: 10.12.2013
C75 C76 = CC0402_1UF_16V_10%_X5R: Non-polarised capacitor; Part Description: SMD Multilayer Chip Ceramic Capacitor; Manufacturer: GENERIC; Manufacturer1 Part Number: C1005X5R1C105KT; Voltage: 16V; TC: X5R; Tolerance: ±10%; Part Number: CC0402_1UF_16V_10%_X5R; Component Kind: Standard; Component Type: Standard; Pin Count: 2; Value: 1uF; Status: Preferred; Manufacturer Part Number: CC0402_1UF_16V_10%_X5R; Case: 0402; Mounted: Yes; Socket: No; SMD: Yes; Sense: No; Manufacturer1 Example: TDK; Manufacturer1 ComponentHeight: 0.55mm; HelpURL: \\cern.ch\dfs\Applications\Altium\Datasheets\CC0402_X5R_TDK_C.pdf; Author: CERN DEM JLC; CreateDate: 25.10.2012; LatestRevisionDate: 25.10.2012
D6 = PRTR5V0U2X: Ultra Low Capacitance Double Rail-to-Rail ESD Protection Diode; Part Description: Ultra Low Capacitance (1pF) Double Rail-to-Rail ESD Protection Diode (8kV); Manufacturer: NXP SEMICONDUCTORS; Voltage: 5.5V; PressFit: No; Bonding: No; Part Number: PRTR5V0U2X; Component Kind: Standard; Component Type: Standard; Device: PRTR5V0U2X; PackageDescription: SOT143B, SOT, 1.90mm Pitch; 4 Pin, 1.30mm W X 2.90mm L X 1.10mm H body, IPC Medium Density; Manufacturer Part Number: PRTR5V0U2X; Pin Count: 4; Case: SOT143B; Mounted: Yes; Socket: No; SMD: Yes; Sense: No; ComponentHeight: 1.1mm; HelpURL: \\cern.ch\dfs\Applications\Altium\Datasheets\PRTR5V0U2X.pdf; Author: CERN DEM JLC; CreateDate: 22.03.2011; LatestRevisionDate: 22.03.2011
IC2 IC13 IC15 = IFC_FIN1028: 3.3V LVDS 2-Bit High-Speed Differential Reciever; Manufacturer: ON Semiconductor; PressFit: No; Bonding: No; Part Number: FIN1028MX; Component Kind: Standard; Component Type: Standard; Device: FIN1028MX; PackageDescription: SOIC 8, Pitch 1.27mm - Body 4x5mm, IPC Medium Density; Part Description: 3.3V LVDS 2-Bit High-Speed Differential Reciever; Manufacturer Part Number: FIN1028MX; Pin Count: 8; Case: SOIC8; Mounted: Yes; Socket: No; SMD: Yes; Sense: No; ComponentHeight: 0.8mm; Author: GK; HelpURL: \\cern.ch\dfs\Applications\Altium\Datasheets\FIN1101K8X.pdf; CreateDate: 08/11/2016; LatestRevisionDate: 08/11/2016
IC4 = IFC_FIN1027A: 3.3V LVDS, 2-Bit, High-Speed, Differential Driver; Manufacturer: ON Semiconductor; PressFit: No; Bonding: No; Part Number: FIN1027AMX; Component Kind: Standard; Component Type: Standard; Device: FIN1027AMX; PackageDescription: SOIC 8, Pitch 1.27mm - Body 4x5mm, IPC Medium Density; Part Description: 3.3V LVDS, 2-Bit, High-Speed, Differential Driver; Manufacturer Part Number: FIN1027AMX; Pin Count: 8; Case: SOIC8; Mounted: Yes; Socket: No; SMD: Yes; Sense: No; ComponentHeight: 0.8mm; Author: GK; HelpURL: \\cern.ch\dfs\Applications\Altium\Datasheets\FIN1101K8X.pdf; CreateDate: 08/11/2016; LatestRevisionDate: 08/11/2016
IC16 = 24AA02E48T-I/OT: 1.7V-5.5V, 2K I2C Serial EEPROM With EUI-48 Node Identity; Manufacturer: MICROCHIP TECHNOLOGY; PressFit: No; Bonding: No; Part Number: 24AA02E48T-I/OT; Component Kind: Standard; Component Type: Standard; Device: 24AA02E48T-I/OT; PackageDescription: SOT, 0.95mm pitch; 5 pin, 1.60mm W X 2.90mm L X 1.45mm H body, IPC Medium Density; Part Description: 1.7V-5.5V, 2K I2C Serial EEPROM With EUI-48 Node Identity; Manufacturer Part Number: 24AA02E48T-I/OT; Pin Count: 5; Case: SOT23-5; Mounted: Yes; Socket: No; SMD: Yes; Sense: No; ComponentHeight: 1.45mm; HelpURL: \\cern.ch\dfs\Applications\Altium\Datasheets\24AA02E48T-I-OT.pdf; Author: CERN DEM MR; CreateDate: 31.03.2016; LatestRevisionDate: 31.03.2016
IC26 IC27 = LM75AIMM/NOPB: Digital Temperature Sensor and Thermal Watchdog with Two-Wire Interface; Part Description: -25° to +100°C ±2°C Digital Temperature Sensor and Thermal Watchdog with Two-Wire Interface; Manufacturer: TEXAS INSTRUMENTS; PressFit: No; Bonding: No; Part Number: LM75AIMM/NOPB; Component Kind: Standard; Component Type: Standard; Device: LM75AIMM/NOPB; PackageDescription: SOP, 0.65mm pitch; 8 pin,3.00mm W X 3.00mm L X 1.09mm H bodyI, PC Medium Density; Manufacturer Part Number: LM75AIMM/NOPB; Pin Count: 8; Case: SSOP8; Mounted: Yes; Socket: No; SMD: Yes; Sense: No; ComponentHeight: 1.09mm; HelpURL: \\cern.ch\dfs\Applications\Altium\Datasheets\LM75AIMM-NOPB.pdf; Author: CERN DEM JLC; CreateDate: 15.10.2012; LatestRevisionDate: 15.10.2012
IC38 = 74LVC1GU04GW: Single Inverter Buffer; Manufacturer: NXP SEMICONDUCTORS; PressFit: No; Bonding: No; Part Number: 74LVC1GU04GW; Component Kind: Standard; Component Type: Standard; Device: 74LVC1GU04GW; PackageDescription: SOT353, SOT, 0.65mm Pitch, 5 pin, 1.25mm W X 2.05mm L X 1.10mm H, IPC Medium Density; Part Description: Inverter; Manufacturer Part Number: 74LVC1GU04GW; Pin Count: 3; Case: SOT353; Mounted: Yes; Socket: No; SMD: Yes; Sense: No; ComponentHeight: 1.1mm; Author: CERN DEM JLC; HelpURL: \\cern.ch\dfs\Applications\Altium\Datasheets\74LVC1GU04GW.pdf; CreateDate: 11.01.2011; LatestRevisionDate: 11.01.2011
J9 = 3M_N2530-6002RB: Connector 30 Male; Part Description: 30 Contacts - Straight .100'' x .100'' Low Profile Four-Wall Header, 2500 Series; Manufacturer: 3M; PressFit: No; Part Number: 3M_N2530-6002RB; Component Kind: Standard; Component Type: Standard; Pin Count: 30; Family: Header 30; Mounted: Yes; Socket: No; SMD: No; Sense: No; Status: None; Manufacturer Part Number: N2530-6002RB; ComponentHeight: 10.03mm; HelpURL: \\cern.ch\dfs\Applications\Altium\Datasheets\3M_N2530-6002RB.pdf; Author: CERN DEM JLC; CreateDate: 11.02.2009; LatestRevisionDate: 11.08.2009
R3-R9 R92 R151 R235 R236 R241-R243 R247 R248 = R0402_0R_JUMPER: Resistor; Part Description: 1A (0.05R Max DC Resistance) Zero Ohm Jumper; Manufacturer: GENERIC; Manufacturer1 Part Number: 232270591001L; PressFit: No; Part Number: R0402_0R_JUMPER; Component Kind: Standard; Component Type: Standard; Pin Count: 2; Value: 0; Status: Not Recommended; Manufacturer Part Number: R0402_0R_JUMPER; Case: 0402; Mounted: Yes; Sense: No; Socket: No; SMD: Yes; Manufacturer1 Example: YAGEO PHYCOMP; Manufacturer1 ComponentHeight: 0.4mm; HelpURL: \\cern.ch\dfs\Applications\Altium\Datasheets\R0402_Phycomp_RC0402.pdf; Author: CERN DEM JLC; CreateDate: 03.12.2007; LatestRevisionDate: 17.10.2012
R16 R34-R39 R44 R45 R62 R80 R82 R158 R169 = R0402_100R_1%_0.0625W_100PPM: Resistor - 1%; Part Description: General Purpose Thick Film Chip Resistor; Manufacturer: GENERIC; Manufacturer1 Part Number: 232270671001L; TC: ±100ppm/°C; PressFit: No; Part Number: R0402_100R_1%_0.0625W_100PPM; Component Kind: Standard; Component Type: Standard; Pin Count: 2; Value: 100; Status: Not Recommended; Power: 0.0625W; Tolerance: ±1%; Manufacturer Part Number: R0402_100R_1%_0.0625W_100PPM; Case: 0402; Mounted: Yes; Sense: No; Socket: No; SMD: Yes; Manufacturer1 Example: YAGEO PHYCOMP; Manufacturer1 ComponentHeight: 0.4mm; HelpURL: \\cern.ch\dfs\Applications\Altium\Datasheets\R0402_Phycomp_RC0402.pdf; Author: CERN DEM JLC; CreateDate: 03.12.2007; LatestRevisionDate: 17.10.2012
R61 = R0402_10K_1%_0.0625W_100PPM: Resistor - 1%; Part Description: General Purpose Thick Film Chip Resistor; Manufacturer: GENERIC; Manufacturer1 Part Number: 232270671003L; TC: ±100ppm/°C; Table: Resistors SMD; Part Number: R0402_10K_1%_0.0625W_100PPM; Component Kind: Standard; Component Type: Standard; Pin Count: 2; Value: 10k; Status: Not recommended; Power: 0.0625W; Tolerance: ±1%; Manufacturer Part Number: R0402_10K_1%_0.0625W_100PPM; Case: 0402; Mounted: Yes; Socket: No; SMD: Yes; Manufacturer1 Example: YAGEO PHYCOMP; Manufacturer1 ComponentHeight: 0.4mm; HelpURL: \\cern.ch\dfs\Applications\Altium\Datasheets\R0402_Phycomp_RC0402.pdf; Author: CERN DEM JLC; CreateDate: 2007-12-03; LatestRevisionDate: 2012-10-17

## Sheet VHFA_PA_DCDC.SchDoc: =MainTitle
size 420 x 297 mm; EDA_Number: ARTIQ; Projet: ARTIQ/SINARA; Author: G.Kasprowicz; CompanyName: WUT ISE; DrawnBy: G.Kasprowicz; Organization: WUT ISE; Address1: PW ISE; Address2: Nowowiejska 15/19 00-665 Warsaw; Address3: gkasprow@gmail.com; DocumentNumber: 5; Revision: 2; SheetNumber: 7; SheetTotal: 9; ModifiedBy: -; CheckedDate: -; Title2: Power Stage Supply; DivGrp: WUT ISE; Designer: G.Kasprowicz; ModifiedDate: -; ProjectName: Sensor Box
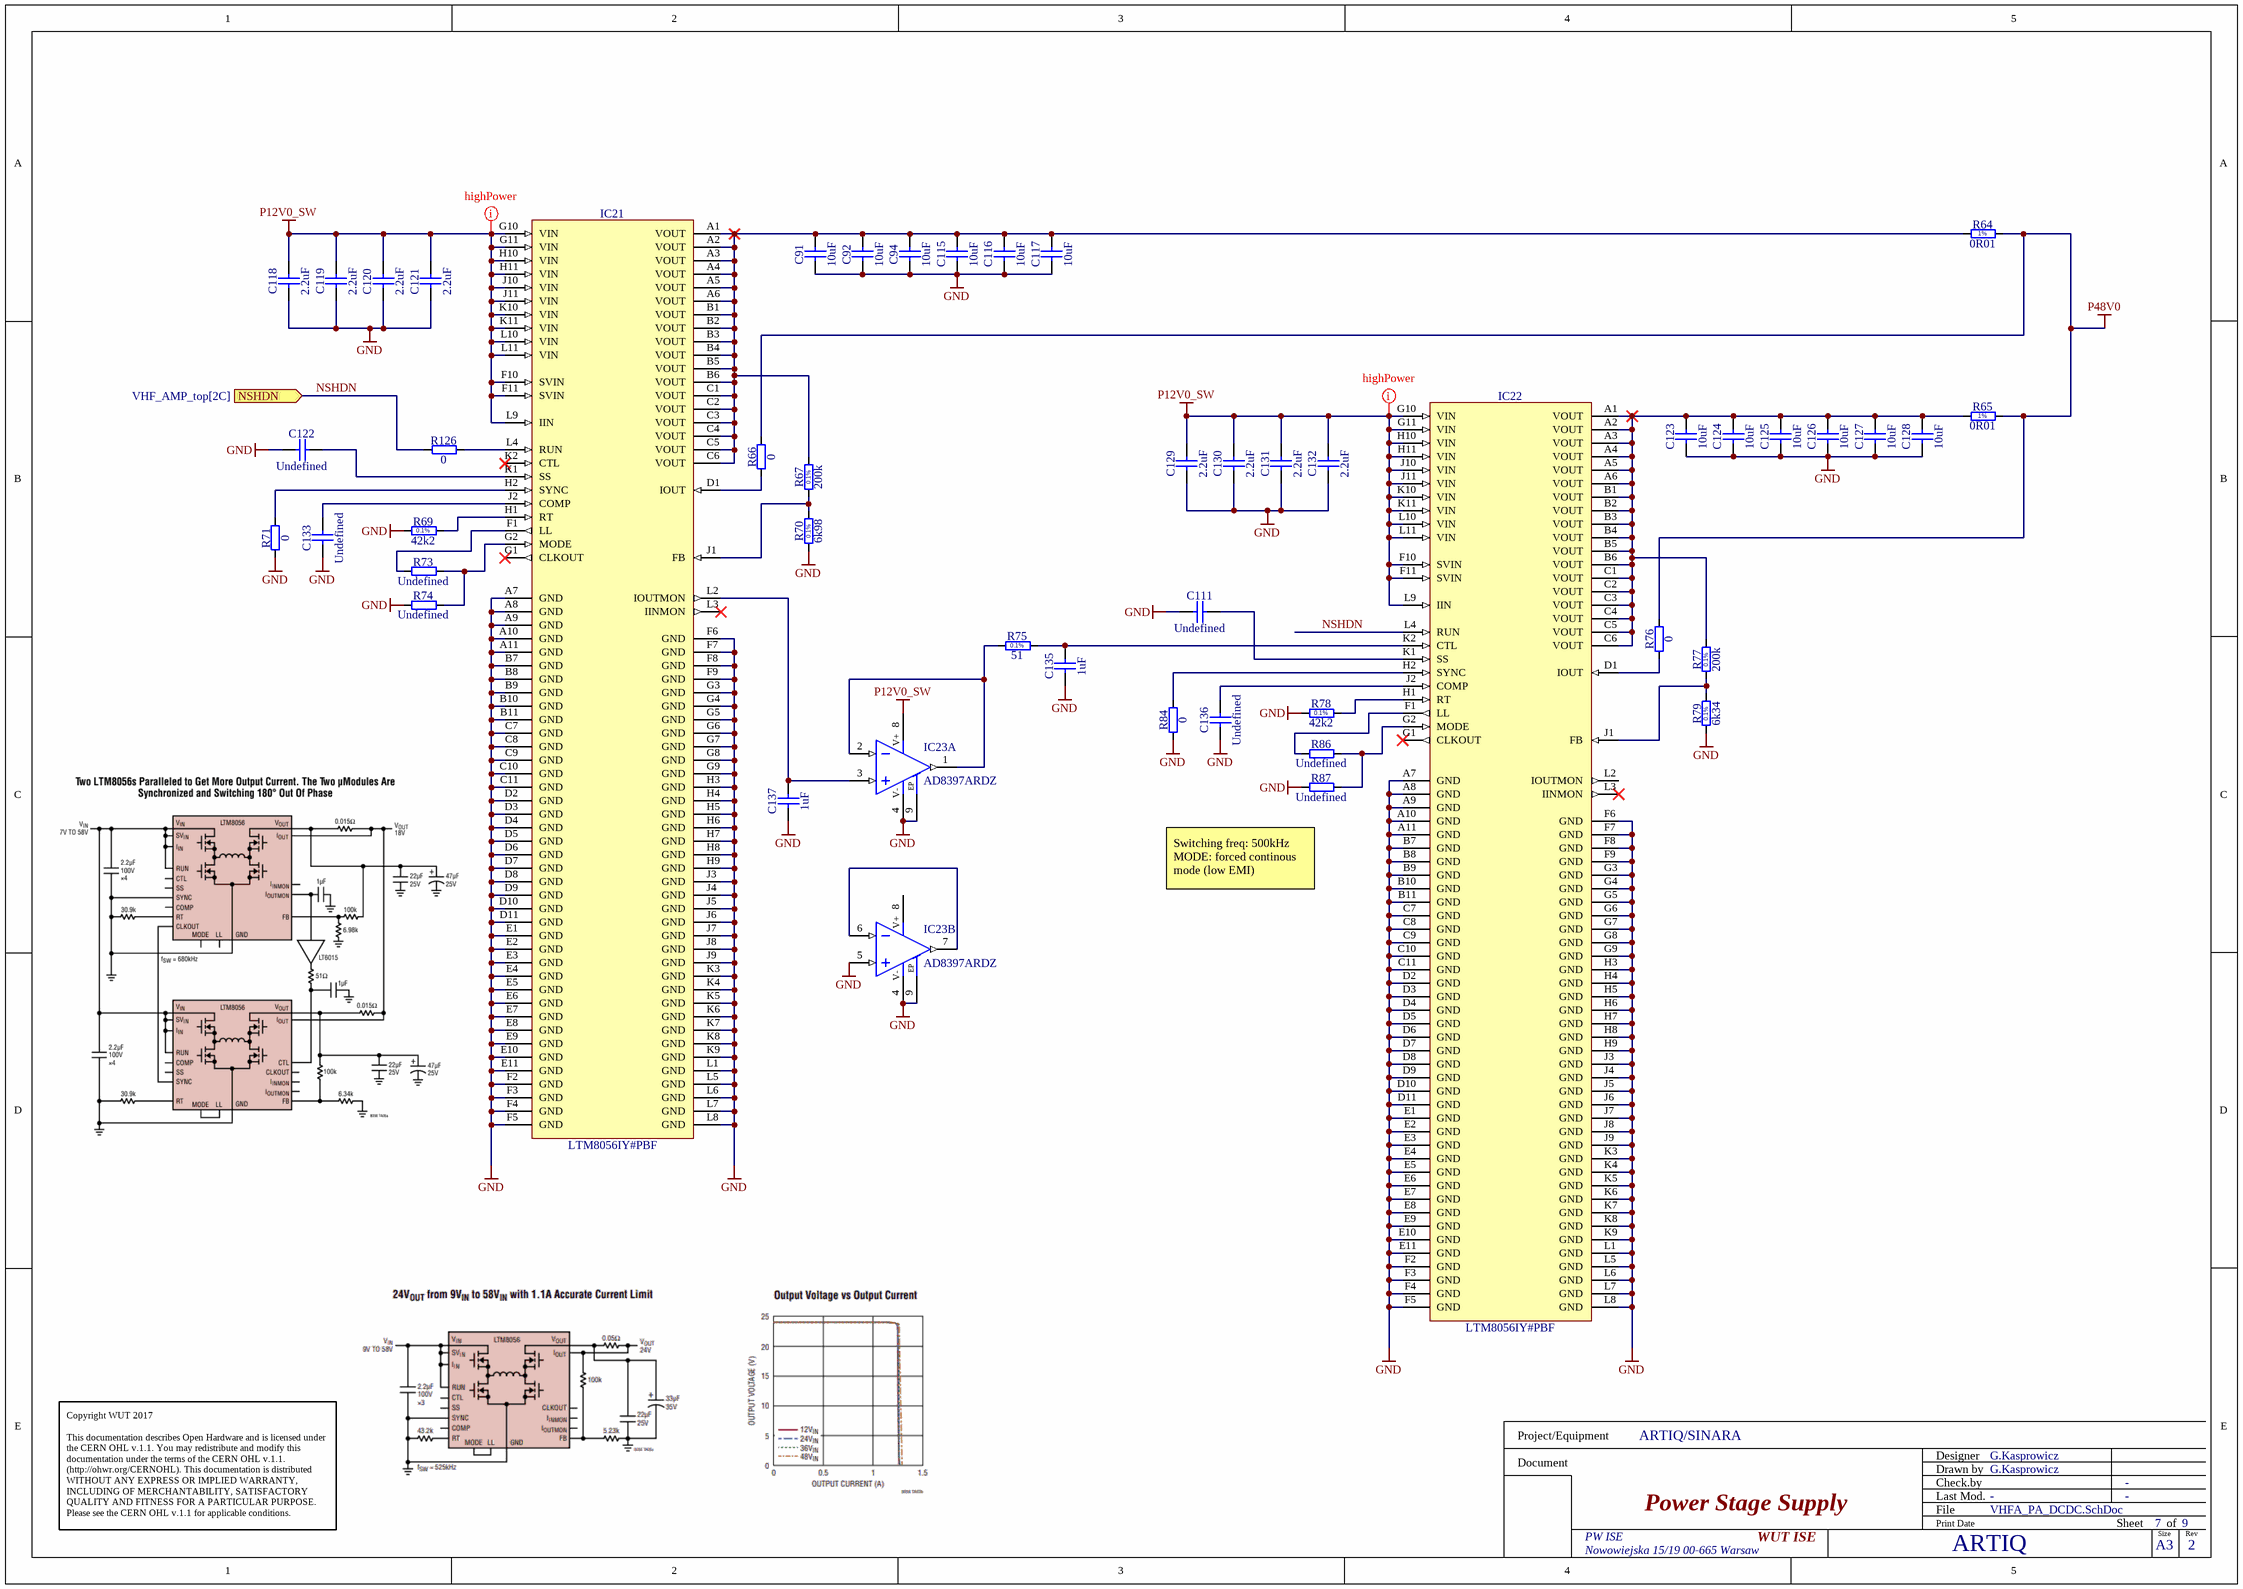
[diagram p6: VHFA_PA_DCDC.SchDoc]

### Parts
C91  10uF  [CAPC_TDK_CKG45N]
C92  10uF  [CAPC_TDK_CKG45N]
C94  10uF  [CAPC_TDK_CKG45N]
C111  Undefined  [CAPC1608X90N]
C115  10uF  [CAPC_TDK_CKG45N]
C116  10uF  [CAPC_TDK_CKG45N]
C117  10uF  [CAPC_TDK_CKG45N]
C118  2.2uF  [CAPC3216X180N]
C119  2.2uF  [CAPC3216X180N]
C120  2.2uF  [CAPC3216X180N]
C121  2.2uF  [CAPC3216X180N]
C122  Undefined  [CAPC1608X90N]
C123  10uF  [CAPC_TDK_CKG45N]
C124  10uF  [CAPC_TDK_CKG45N]
C125  10uF  [CAPC_TDK_CKG45N]
C126  10uF  [CAPC_TDK_CKG45N]
C127  10uF  [CAPC_TDK_CKG45N]
C128  10uF  [CAPC_TDK_CKG45N]
C129  2.2uF  [CAPC3216X180N]
C130  2.2uF  [CAPC3216X180N]
C131  2.2uF  [CAPC3216X180N]
C132  2.2uF  [CAPC3216X180N]
C133  Undefined  [CAPC1608X90N]
C135  1uF  [CAPC1608X87N]
C136  Undefined  [CAPC1608X90N]
C137  1uF  [CAPC1608X87N]
IC21  LTM8056IY#PBF  [BGA121C127P11X11_1500X1500X512]
IC22  LTM8056IY#PBF  [BGA121C127P11X11_1500X1500X512]
IC23  AD8397ARDZ  [SOIC127P600X175-9N-R241X309]  (parts A,B of 2)
R64  0R01  [RESC3216X80N]
R65  0R01  [RESC3216X80N]
R66  0  [RESC1608X55N]
R67  200k  [RESC1608X55N]
R69  42k2  [RESC1608X55N]
R70  6k98  [RESC1608X55N]
R71  0  [RESC1608X55N]
R73  Undefined  [RESC1608X55N]
R74  Undefined  [RESC1608X55N]
R75  51  [RESC1608X55N]
R76  0  [RESC1608X55N]
R77  200k  [RESC1608X55N]
R78  42k2  [RESC1608X55N]
R79  6k34  [RESC1608X55N]
R84  0  [RESC1608X55N]
R86  Undefined  [RESC1608X55N]
R87  Undefined  [RESC1608X55N]
R126  0  [RESC1608X55N]

### Ports
NSHDN (in, see VHF_AMP_top[2C])

### Nets
GND: C91.1 C92.1 C94.1 C111.1 C115.1 C116.1 C117.1 C118.1 C119.1 C120.1 C121.1 C122.1 C123.1 C124.1 C125.1 C126.1 C127.1 C128.1 C129.1 C130.1 C131.1 C132.1 C133.1 C135.1 C136.1 C137.1 IC21.A7(GND) IC21.A8(GND) IC21.A9(GND) IC21.A10(GND) IC21.A11(GND) IC21.B7(GND) IC21.B8(GND) IC21.B9(GND) IC21.B10(GND) IC21.B11(GND) IC21.C7(GND) IC21.C8(GND) IC21.C9(GND) IC21.C10(GND) IC21.C11(GND) IC21.D2(GND) IC21.D3(GND) IC21.D4(GND) IC21.D5(GND) IC21.D6(GND) IC21.D7(GND) IC21.D8(GND) IC21.D9(GND) IC21.D10(GND) IC21.D11(GND) IC21.E1(GND) IC21.E2(GND) IC21.E3(GND) IC21.E4(GND) IC21.E5(GND) IC21.E6(GND) IC21.E7(GND) IC21.E8(GND) IC21.E9(GND) IC21.E10(GND) IC21.E11(GND) IC21.F2(GND) IC21.F3(GND) IC21.F4(GND) IC21.F5(GND) IC21.F6(GND) IC21.F7(GND) IC21.F8(GND) IC21.F9(GND) IC21.G3(GND) IC21.G4(GND) IC21.G5(GND) IC21.G6(GND) IC21.G7(GND) IC21.G8(GND) IC21.G9(GND) IC21.H3(GND) IC21.H4(GND) IC21.H5(GND) IC21.H6(GND) IC21.H7(GND) IC21.H8(GND) IC21.H9(GND) IC21.J3(GND) IC21.J4(GND) IC21.J5(GND) IC21.J6(GND) IC21.J7(GND) IC21.J8(GND) IC21.J9(GND) IC21.K3(GND) IC21.K4(GND) IC21.K5(GND) IC21.K6(GND) IC21.K7(GND) IC21.K8(GND) IC21.K9(GND) IC21.L1(GND) IC21.L5(GND) IC21.L6(GND) IC21.L7(GND) IC21.L8(GND) IC22.A7(GND) IC22.A8(GND) IC22.A9(GND) IC22.A10(GND) IC22.A11(GND) IC22.B7(GND) IC22.B8(GND) IC22.B9(GND) IC22.B10(GND) IC22.B11(GND) IC22.C7(GND) IC22.C8(GND) IC22.C9(GND) IC22.C10(GND) IC22.C11(GND) IC22.D2(GND) IC22.D3(GND) IC22.D4(GND) IC22.D5(GND) IC22.D6(GND) IC22.D7(GND) IC22.D8(GND) IC22.D9(GND) IC22.D10(GND) IC22.D11(GND) IC22.E1(GND) IC22.E2(GND) IC22.E3(GND) IC22.E4(GND) IC22.E5(GND) IC22.E6(GND) IC22.E7(GND) IC22.E8(GND) IC22.E9(GND) IC22.E10(GND) IC22.E11(GND) IC22.F2(GND) IC22.F3(GND) IC22.F4(GND) IC22.F5(GND) IC22.F6(GND) IC22.F7(GND) IC22.F8(GND) IC22.F9(GND) IC22.G3(GND) IC22.G4(GND) IC22.G5(GND) IC22.G6(GND) IC22.G7(GND) IC22.G8(GND) IC22.G9(GND) IC22.H3(GND) IC22.H4(GND) IC22.H5(GND) IC22.H6(GND) IC22.H7(GND) IC22.H8(GND) IC22.H9(GND) IC22.J3(GND) IC22.J4(GND) IC22.J5(GND) IC22.J6(GND) IC22.J7(GND) IC22.J8(GND) IC22.J9(GND) IC22.K3(GND) IC22.K4(GND) IC22.K5(GND) IC22.K6(GND) IC22.K7(GND) IC22.K8(GND) IC22.K9(GND) IC22.L1(GND) IC22.L5(GND) IC22.L6(GND) IC22.L7(GND) IC22.L8(GND) IC23.4(V-) IC23.5(IN+) IC23.9(Exposed_Pad) R69.1 R70.1 R71.1 R74.1 R78.1 R79.1 R84.1 R87.1
P12V0_SW: C118.2 C119.2 C120.2 C121.2 C129.2 C130.2 C131.2 C132.2 IC21.F10(SVIN) IC21.F11(SVIN) IC21.G10(VIN) IC21.G11(VIN) IC21.H10(VIN) IC21.H11(VIN) IC21.J10(VIN) IC21.J11(VIN) IC21.K10(VIN) IC21.K11(VIN) IC21.L9(IIN) IC21.L10(VIN) IC21.L11(VIN) IC22.F10(SVIN) IC22.F11(SVIN) IC22.G10(VIN) IC22.G11(VIN) IC22.H10(VIN) IC22.H11(VIN) IC22.J10(VIN) IC22.J11(VIN) IC22.K10(VIN) IC22.K11(VIN) IC22.L9(IIN) IC22.L10(VIN) IC22.L11(VIN) IC23.8(V+)
P48V0: R64.2 R65.2 R66.2 R76.2
NSHDN: IC22.L4(RUN) R126.1 ; port NSHDN
NetC91_2: C91.2 C92.2 C94.2 C115.2 C116.2 C117.2 IC21.A1(VOUT) IC21.A2(VOUT) IC21.A3(VOUT) IC21.A4(VOUT) IC21.A5(VOUT) IC21.A6(VOUT) IC21.B1(VOUT) IC21.B2(VOUT) IC21.B3(VOUT) IC21.B4(VOUT) IC21.B5(VOUT) IC21.B6(VOUT) IC21.C1(VOUT) IC21.C2(VOUT) IC21.C3(VOUT) IC21.C4(VOUT) IC21.C5(VOUT) IC21.C6(VOUT) R64.1 R67.2
NetC111_2: C111.2 IC22.K1(SS)
NetC122_2: C122.2 IC21.K1(SS)
NetC123_2: C123.2 C124.2 C125.2 C126.2 C127.2 C128.2 IC22.A1(VOUT) IC22.A2(VOUT) IC22.A3(VOUT) IC22.A4(VOUT) IC22.A5(VOUT) IC22.A6(VOUT) IC22.B1(VOUT) IC22.B2(VOUT) IC22.B3(VOUT) IC22.B4(VOUT) IC22.B5(VOUT) IC22.B6(VOUT) IC22.C1(VOUT) IC22.C2(VOUT) IC22.C3(VOUT) IC22.C4(VOUT) IC22.C5(VOUT) IC22.C6(VOUT) R65.1 R77.2
NetC133_2: C133.2 IC21.J2(COMP)
NetC135_2: C135.2 IC22.K2(CTL) R75.2
NetC136_2: C136.2 IC22.J2(COMP)
NetC137_2: C137.2 IC21.L2(IOUTMON) IC23.3(IN+)
NetIC21_D1: IC21.D1(IOUT) R66.1
NetIC21_F1: IC21.F1(LL) R73.1
NetIC21_G2: IC21.G2(MODE) R73.2 R74.2
NetIC21_H1: IC21.H1(RT) R69.2
NetIC21_H2: IC21.H2(SYNC) R71.2
NetIC21_J1: IC21.J1(FB) R67.1 R70.2
NetIC21_L4: IC21.L4(RUN) R126.2
NetIC22_D1: IC22.D1(IOUT) R76.1
NetIC22_F1: IC22.F1(LL) R86.1
NetIC22_G2: IC22.G2(MODE) R86.2 R87.2
NetIC22_H1: IC22.H1(RT) R78.2
NetIC22_H2: IC22.H2(SYNC) R84.2
NetIC22_J1: IC22.J1(FB) R77.1 R79.2
NetIC23_1: IC23.1(OUT) IC23.2(IN-) R75.1
NetIC23_6: IC23.6(IN-) IC23.7(OUT)

Not connected (* = marked no-connect by the designer): IC21 G1(CLKOUT)* K2(CTL)* L3(IINMON)*; IC22 G1(CLKOUT)* L2(IOUTMON) L3(IINMON)*

### Layout directives
net class highPower: P12V0_SW

### Notes on the sheet
- (near R87) Switching freq: 500kHz
  MODE: forced continous mode (low EMI)
- Project/Equipment
- Document
- Designer
- Drawn by
- Check.by
- Copyright WUT 2017
  This documentation describes Open Hardware and is licensed under the CERN OHL v.1.1. You may redistribute and modify this documentation under the terms of the CERN OHL v.1.1. (http://ohwr.org/CERNOHL). This documentation is distributed WITHOUT ANY EXPRESS OR IMPLIED WARRANTY, INCLUDING OF MERCHANTABILITY, SATISFACTORY QUALITY AND FITNESS FOR A PARTICULAR PURPOSE. Please see the CERN OHL v.1.1 for applicable conditions.
- File
- Last Mod.
- Print Date
- Sheet
- Size
- A3
- of
- Rev
- (in symbol AD8397ARDZ, part A) EP
- (in symbol AD8397ARDZ, part B) EP
- (in symbol R0603_6K34_0.1%_0.063W_10PPM) 0.1%
- (in symbol R0603_6K98_0.1%_0.063W_10PPM) 0.1%
- (in symbol R0603_42K2_0.1%_0.063W_10PPM) 0.1%
- (in symbol R0603_51R_0.1%_0.063W_25PPM) 0.1%
- (in symbol R0603_200K_0.1%_0.063W_10PPM) 0.1%
- (in symbol R1206_0R01_1%_1W_100PPM_TT_LRMAM1206) 1%

### Library data of the parts
C91 C92 C94 C115-C117 C123-C128 = CC1812_10UF_100V_20%_X7S_TDK_CKG45N: Non-polarised capacitor; Part Description: Multilayer Ceramic Chip Capacitor - Stacked Cap, CKG45N Series; Manufacturer: TDK; Manufacturer Part Number: CKG45NX7S2A106M500JH; Voltage: 100V; TC: X7S; Tolerance: ±20%; Part Number: CC1812_10UF_100V_20%_X7S_TDK_CKG45N; Component Kind: Standard; Component Type: Standard; Pin Count: 2; Value: 10uF; Status: None; Case: 1812; Mounted: Yes; Socket: No; SMD: Yes; Sense: No; ComponentHeight: 5.5mm; HelpURL: \\cern.ch\dfs\Applications\Altium\Datasheets\CC1812_X7S_TDK_CKG.pdf; Author: CERN DEM MR; CreateDate: 14.12.2017; LatestRevisionDate: 14.12.2017
C111 C122 C133 C136 = CC0603_NO-VALUE: Non-polarised capacitor; Part Description: Reserved Footprint For 0603(1608) Chip Ceramic Capacitor; Mounted: No; Part Number: CC0603_NO-VALUE; Component Kind: Standard; Component Type: Standard; Pin Count: 2; Value: Undefined; Status: None; Manufacturer: Undefined; Manufacturer Part Number: CC0603_NO-VALUE; Case: 0603; Socket: No; SMD: Yes; Sense: No; Manufacturer1 ComponentHeight: 0.9mm; HelpURL: Undefined; Author: CERN DEM MR; CreateDate: 22.11.2016; LatestRevisionDate: 22.11.2016
C118-C121 C129-C132 = CC1206_2.2UF_50V_10%_X7R: Non-polarised capacitor; Part Description: SMD Multilayer Chip Ceramic Capacitor; Manufacturer: GENERIC; Manufacturer1 Part Number: C1206C225K5RACTU; Voltage: 50V; TC: X7R; Tolerance: ±10%; Part Number: CC1206_2.2UF_50V_10%_X7R; Component Kind: Standard; Component Type: Standard; Pin Count: 2; Value: 2.2uF; Status: Preferred; Manufacturer Part Number: CC1206_2.2uF_50V_10%_X7R; Case: 1206; Mounted: Yes; Socket: No; SMD: Yes; Sense: No; Manufacturer1 Example: KEMET; Manufacturer1 ComponentHeight: 1.8mm; HelpURL: \\cern.ch\dfs\Applications\Altium\Datasheets\CC1206_X7R_KEMET.pdf; Author: CERN DEM MR; CreateDate: 06.06.2016; LatestRevisionDate: 06.06.2016
C135 C137 = CC0603_1UF_25V_10%_X7R: Non-polarised capacitor; Part Description: SMD Multilayer Chip Ceramic Capacitor; Manufacturer: GENERIC; Manufacturer1 Part Number: GRM188R71E105KA12D; Voltage: 25V; TC: X7R; Tolerance: ±10%; Part Number: CC0603_1UF_25V_10%_X7R; Component Kind: Standard; Component Type: Standard; Pin Count: 2; Value: 1uF; Status: None; Manufacturer Part Number: CC0603_1UF_25V_10%_X7R; Case: 0603; Mounted: Yes; Socket: No; SMD: Yes; Sense: No; Manufacturer1 Example: MURATA; Manufacturer1 ComponentHeight: 0.9mm; HelpURL: \\cern.ch\dfs\Applications\Altium\Datasheets\CC0603_X7R_MURATA.pdf; Author: CERN DEM JLC; CreateDate: 18.01.2011; LatestRevisionDate: 18.01.2011
IC21 IC22 = LTM8056IY#PBF: 58VIN, 48VOUT Buck-Boost µModule Regulator; Manufacturer: LINEAR TECHNOLOGY; PressFit: No; Bonding: No; Part Number: LTM8056IY#PBF; Component Kind: Standard; Component Type: Standard; Device: LTM8056IY#PBF; PackageDescription: BGA,1.27mm Pitch, Square;121 Pin, 11 Columns X 11 Rows, 15.00mm X 15.00mm X 5.12mm H; Part Description: 58VIN, 48VOUT Buck-Boost µModule Regulator; Manufacturer Part Number: LTM8056IY#PBF; Pin Count: 121; Case: BGA121; Mounted: Yes; Socket: No; SMD: Yes; Sense: No; ComponentHeight: 5.12mm; HelpURL: \\cern.ch\dfs\Applications\Altium\Datasheets\LTM8056IY#PBF.pdf; Author: CERN DEM JLC; CreateDate: 08.04.2019; LatestRevisionDate: 08.04.2019
IC23 = AD8397ARDZ: Dual Operational Amplifier With Exposed Pad; Part Description: Rail-to-Rail, High Output Current Amplifier; Manufacturer: ANALOG DEVICES; PressFit: No; Bonding: No; Part Number: AD8397ARDZ; Component Kind: Standard; Component Type: Standard; Device: AD8397ARDZ; PackageDescription: SOIC 8, Pitch 1.27mm - Body 3.9x4.9mm, (w/thermal tab 2.41mm X 3.098mm), IPC Medium Density; Manufacturer Part Number: AD8397ARDZ; Pin Count: 9; Case: SOIC8; Mounted: Yes; Socket: No; SMD: Yes; Sense: No; ComponentHeight: 1.75mm; Author: CERN DEM JLC; HelpURL: \\cern.ch\dfs\Applications\Altium\Datasheets\AD8397ARDZ.pdf; CreateDate: 31.05.2011; LatestRevisionDate: 31.05.2011
R64 R65 = R1206_0R01_1%_1W_100PPM_TT_LRMAM1206: Resistor - 1%; Part Description: Low Value Metal Alloy Resistor; Manufacturer: TT Electronics; Manufacturer Part Number: LRMAM1206-R01FT5; Power: 1W; TC: ±100ppm/°C; PressFit: No; Part Number: R1206_0R01_1%_1W_100PPM_TT_LRMAM1206; Component Kind: Standard; Component Type: Standard; Pin Count: 2; Value: 0R01; Status: Not Recommended; Tolerance: ±1%; Case: 1206; Mounted: Yes; Sense: No; Socket: No; SMD: Yes; ComponentHeight: 0.8mm; HelpURL: \\cern.ch\dfs\Applications\Altium\Datasheets\R1206_TT ELECTRONICS_LRMA.pdf; Author: CERN DEM BC; CreateDate: 29.07.2015; LatestRevisionDate: 29.07.2015
R66 R71 R76 R84 R126 = R0603_0R_JUMPER: Resistor; Part Description: 1A (0.05R Max DC Resistance) Zero Ohm Jumper; Manufacturer: GENERIC; Manufacturer1 Part Number: NRC06Z0; PressFit: No; Part Number: R0603_0R_JUMPER; Component Kind: Standard; Component Type: Standard; Pin Count: 2; Value: 0; Status: Preferred; Manufacturer Part Number: R0603_0R_JUMPER; Case: 0603; Mounted: Yes; Sense: No; Socket: No; SMD: Yes; Manufacturer1 Example: NIC COMPONENT; Manufacturer1 ComponentHeight: 0.55mm; HelpURL: \\cern.ch\dfs\Applications\Altium\Datasheets\R0603_NIC_NRC.pdf; Author: CERN DEM JLC; CreateDate: 03.12.2007; LatestRevisionDate: 13.03.2008
R67 R77 = R0603_200K_0.1%_0.063W_10PPM: Resistor - 0.1%; Part Description: Thin Film Chip Resistor; Manufacturer: GENERIC; Manufacturer1 Part Number: RN73C1J200KBTDF; Power: 0.063W; TC: ±10ppm; PressFit: No; Part Number: R0603_200K_0.1%_0.063W_10PPM; Component Kind: Standard; Component Type: Standard; Pin Count: 2; Value: 200k; Status: Not Recommended; Tolerance: ±0.1%; Manufacturer Part Number: R0603_200K_0.1%_0.063W_10PPM; Case: 0603; Mounted: Yes; Sense: No; Socket: No; SMD: Yes; Manufacturer1 Example: TYCO HOLSWORTHY; Manufacturer1 ComponentHeight: 0.5mm; HelpURL: \\cern.ch\dfs\Applications\Altium\Datasheets\R0603_Tyco_RN73.pdf; Author: CERN DEM MR; CreateDate: 12.10.2017; LatestRevisionDate: 12.10.2017
R69 R78 = R0603_42K2_0.1%_0.063W_10PPM: Resistor - 0.1%; Part Description: Thin Film Chip Resistor; Manufacturer: GENERIC; Manufacturer1 Part Number: RN73C1J42K2BTDF; Power: 0.063W; TC: ±10ppm; PressFit: No; Part Number: R0603_42K2_0.1%_0.063W_10PPM; Component Kind: Standard; Component Type: Standard; Pin Count: 2; Value: 42k2; Status: Not Recommended; Tolerance: ±0.1%; Manufacturer Part Number: R0603_42K2_0.1%_0.063W_10PPM; Case: 0603; Mounted: Yes; Sense: No; Socket: No; SMD: Yes; Manufacturer1 Example: TYCO HOLSWORTHY; Manufacturer1 ComponentHeight: 0.5mm; HelpURL: \\cern.ch\dfs\Applications\Altium\Datasheets\R0603_Tyco_RN73.pdf; Author: CERN DEM JLC; CreateDate: 03.12.2007; LatestRevisionDate: 13.03.2008
R70 = R0603_6K98_0.1%_0.063W_10PPM: Resistor - 0.1%; Part Description: Thin Film Chip Resistor; Manufacturer: GENERIC; Manufacturer1 Part Number: RN73C1J6K98BTDF; Power: 0.063W; TC: ±10ppm; PressFit: No; Part Number: R0603_6K98_0.1%_0.063W_10PPM; Component Kind: Standard; Component Type: Standard; Pin Count: 2; Value: 6k98; Status: Not Recommended; Tolerance: ±0.1%; Manufacturer Part Number: R0603_6K98_0.1%_0.063W_10PPM; Case: 0603; Mounted: Yes; Sense: No; Socket: No; SMD: Yes; Manufacturer1 Example: TYCO HOLSWORTHY; Manufacturer1 ComponentHeight: 0.5mm; HelpURL: \\cern.ch\dfs\Applications\Altium\Datasheets\R0603_Tyco_RN73.pdf; Author: CERN DEM JLC; CreateDate: 03.12.2007; LatestRevisionDate: 13.03.2008
R73 R74 R86 R87 = R0603_NO-VALUE: Resistor; Part Description: Reserved Footprint For a 0603 (1608) Chip Resistor; PressFit: No; Mounted: No; Part Number: R0603_NO-VALUE; Component Kind: Standard; Component Type: Standard; Pin Count: 2; Value: Undefined; Status: None; Manufacturer: Undefined; Manufacturer Part Number: R0603_NO-VALUE; Case: 0603; Sense: No; Socket: No; SMD: Yes; Manufacturer1 Example: Undefined; Manufacturer1 Part Number: Undefined; Manufacturer1 ComponentHeight: Undefined; HelpURL: Undefined; Author: CERN DEM JLC; CreateDate: 03.12.2007; LatestRevisionDate: 13.03.2008
R75 = R0603_51R_0.1%_0.063W_25PPM: Resistor - 0.1%; Part Description: Thin Film Chip Resistor; Manufacturer: GENERIC; Manufacturer1 Part Number: CPF0603B51RE1; Power: 0.063W; TC: ±25ppm; PressFit: No; Part Number: R0603_51R_0.1%_0.063W_25PPM; Component Kind: Standard; Component Type: Standard; Pin Count: 2; Value: 51; Status: Not Recommended; Tolerance: ±0.1%; Manufacturer Part Number: R0603_51R_0.1%_0.063W_25PPM; Case: 0603; Mounted: Yes; Sense: No; Socket: No; SMD: Yes; Manufacturer1 Example: TE CONNECTIVITY; Manufacturer1 ComponentHeight: 0.55mm; HelpURL: \\cern.ch\dfs\Applications\Altium\Datasheets\R0603_TYCO_CPF.pdf; Author: CERN DEM JLC; CreateDate: 12.01.2017; LatestRevisionDate: 12.01.2017
R79 = R0603_6K34_0.1%_0.063W_10PPM: Resistor - 0.1%; Part Description: Thin Film Chip Resistor; Manufacturer: GENERIC; Manufacturer1 Part Number: RN73C1J6K34BTDF; Power: 0.063W; TC: ±10ppm; PressFit: No; Part Number: R0603_6K34_0.1%_0.063W_10PPM; Component Kind: Standard; Component Type: Standard; Pin Count: 2; Value: 6k34; Status: Not Recommended; Tolerance: ±0.1%; Manufacturer Part Number: R0603_6K34_0.1%_0.063W_10PPM; Case: 0603; Mounted: Yes; Sense: No; Socket: No; SMD: Yes; Manufacturer1 Example: TYCO HOLSWORTHY; Manufacturer1 ComponentHeight: 0.5mm; HelpURL: \\cern.ch\dfs\Applications\Altium\Datasheets\R0603_Tyco_RN73.pdf; Author: CERN DEM JLC; CreateDate: 03.12.2007; LatestRevisionDate: 13.03.2008